# EAGLE schematic Avionics (EAGLE 9.5.1)
DESIGNER: Gabe Adamson; PART_NUMBER: 68-0004; PROJECT: CougSat-1: Avionics; REV: 1.3.0

## Sheet 1 of 14
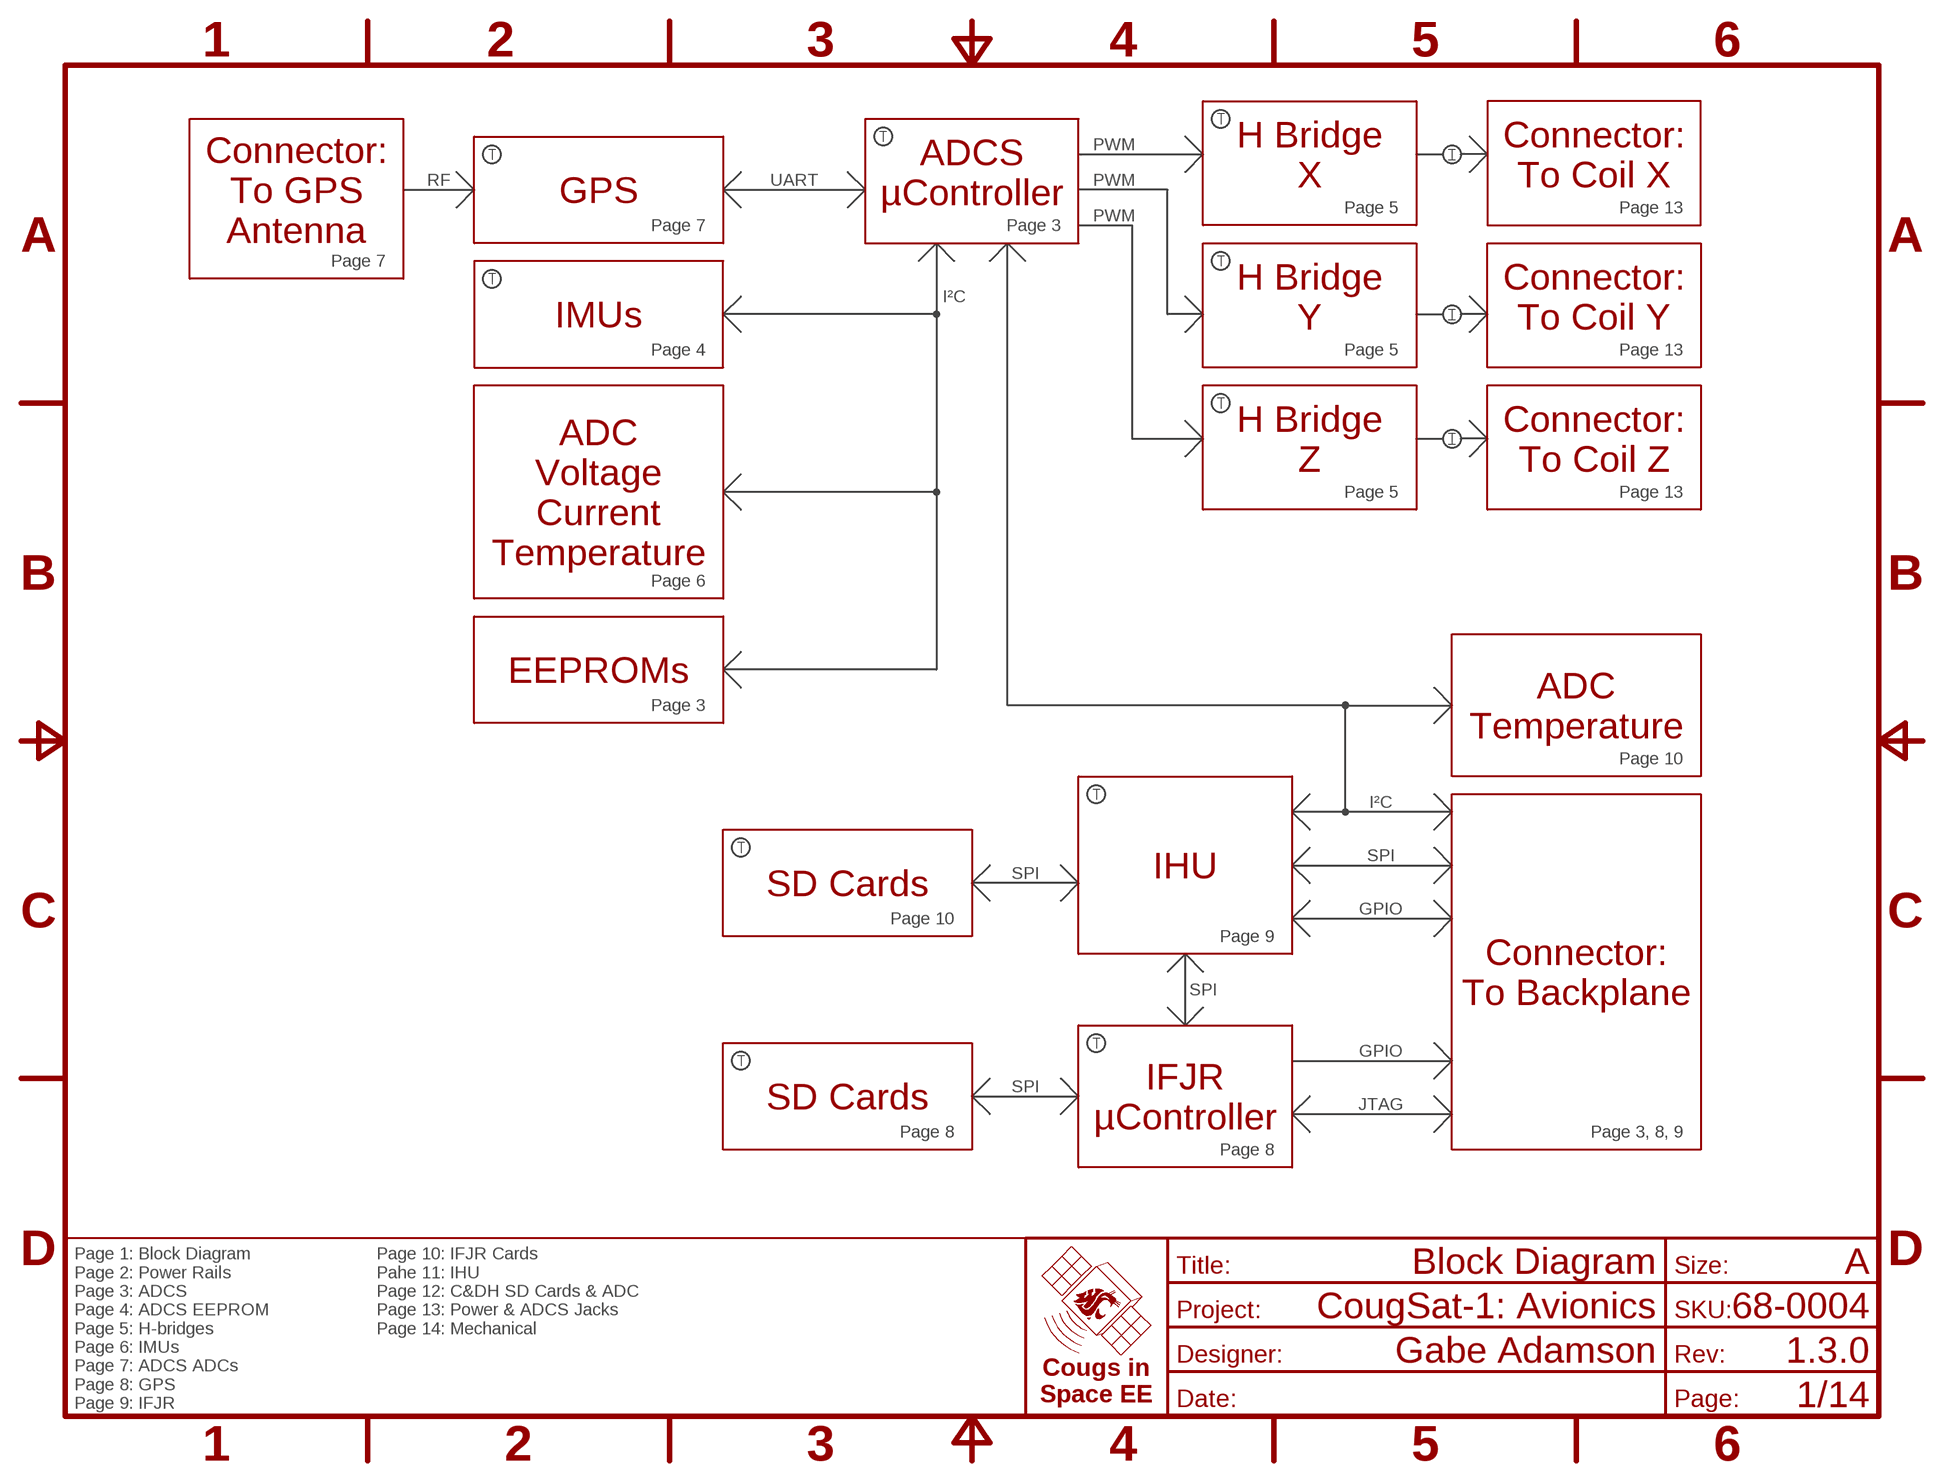
[diagram p0: schematic, sheet 1]
FRAME1 (FRAME-A): TITLE: Block Diagram

### Notes on the sheet
- PWM
- H Bridge
  X
- Connector:
  To Coil X
- ADCS
  µController
- RF | UART | PWM
- Connector:
  To GPS
  Antenna
- GPS
- Page 5 | Page 13
- Page 7 | Page 3 | PWM
- Page 7
- I²C
- H Bridge
  Y
- Connector:
  To Coil Y
- IMUs
- Page 4 | Page 5 | Page 13
- H Bridge
  Z
- Connector:
  To Coil Z
- ADC
  Voltage
  Current
  Temperature
- Page 5 | Page 13
- Page 6
- EEPROMs
- Page 3
- ADC
  Temperature
- Page 10
- I²C
- IHU | SPI
- SD Cards | SPI
- Page 10 | GPIO
- Page 9
- Connector:
  To Backplane
- SPI
- GPIO
- SD Cards | SPI
- IFJR
  µController
- JTAG
- Page 8 | Page 3, 8, 9
- Page 8
- Page 1: Block Diagram
  Page 2: Power Rails
  Page 3: ADCS
  Page 4: ADCS EEPROM
  Page 5: H-bridges
  Page 6: IMUs
  Page 7: ADCS ADCs
  Page 8: GPS
  Page 9: IFJR
- Page 10: IFJR Cards
  Pahe 11: IHU
  Page 12: C&DH SD Cards & ADC
  Page 13: Power & ADCS Jacks
  Page 14: Mechanical

## Sheet 2 of 14
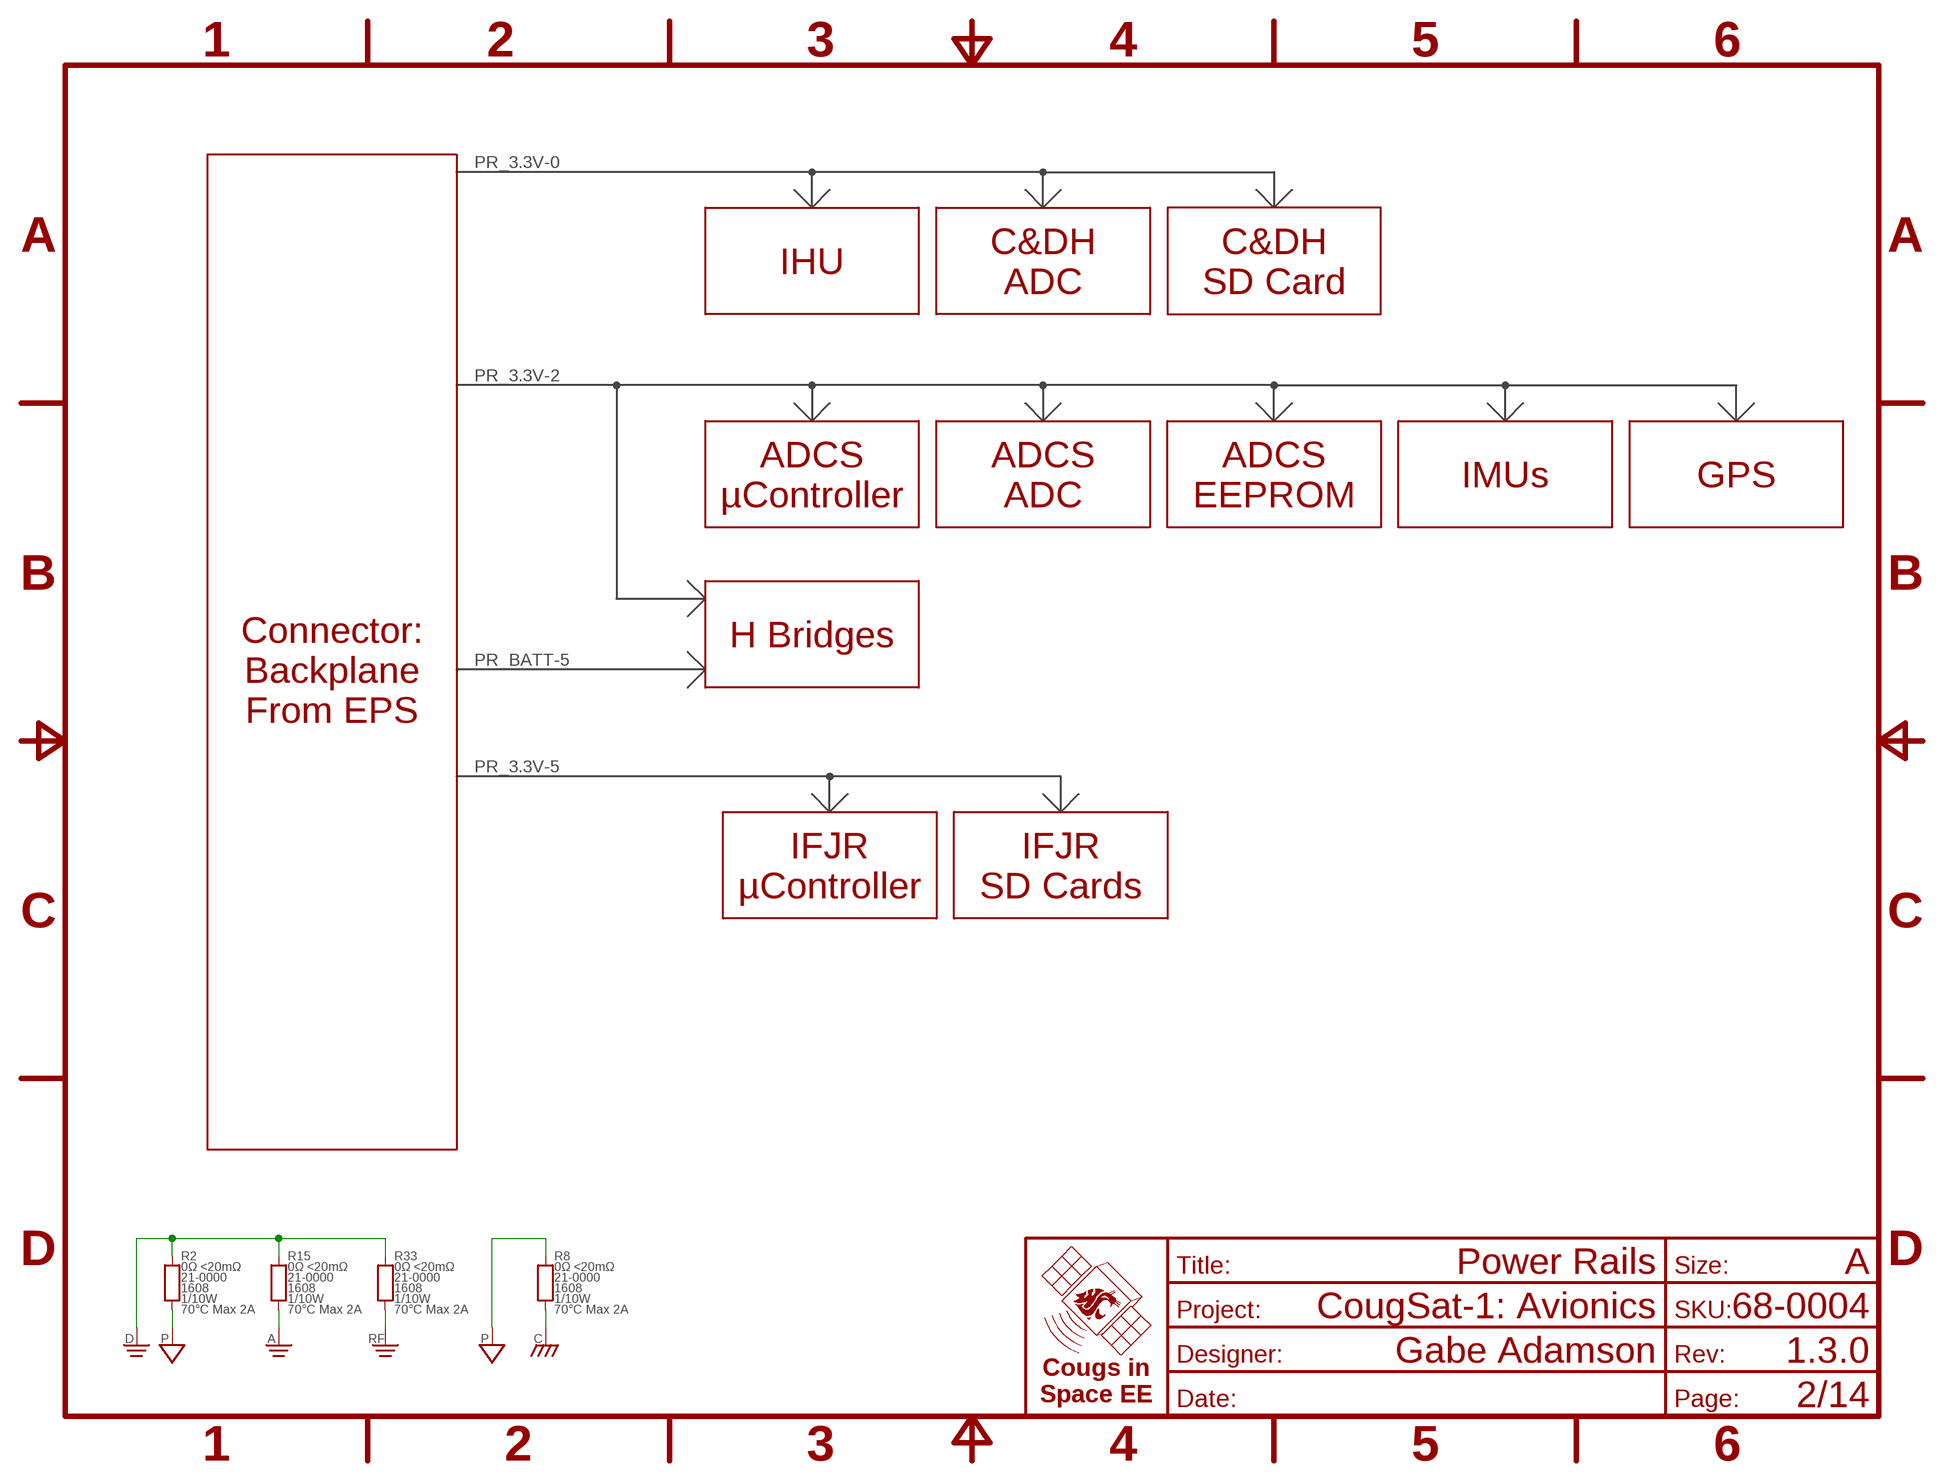
[diagram p1: schematic, sheet 2]
FRAME2 (FRAME-A): TITLE: Power Rails

### Parts
R2  0Ω <20mΩ  RES-V-0-1608  [1608]
R8  0Ω <20mΩ  RES-V-0-1608  [1608]
R15  0Ω <20mΩ  RES-V-0-1608  [1608]
R33  0Ω <20mΩ  RES-V-0-1608  [1608]

### Nets
AGND [Power]: R15.1 ; also sheet 3,5,6,7,8,9,10,11,12
CHASSIS [Power]: R8.1 ; also sheet 13
DGND [Power]: R2.2 R15.2 R33.2 ; also sheet 3,4,6,7,8,9,10,11,12,13
PGND [Power]: R2.1 R8.2 ; also sheet 5,13
RFGND [Power]: R33.1 ; also sheet 8

### Notes on the sheet
- PR_3.3V-0
- IHU
- C&DH
  ADC
- C&DH
  SD Card
- PR_3.3V-2
- ADCS
  µController
- ADCS
  ADC
- ADCS
  EEPROM
- IMUs | GPS
- H Bridges
- PR_BATT-5
- Connector:
  Backplane
  From EPS
- PR_3.3V-5
- IFJR
  µController
- IFJR
  SD Cards

## Sheet 3 of 14
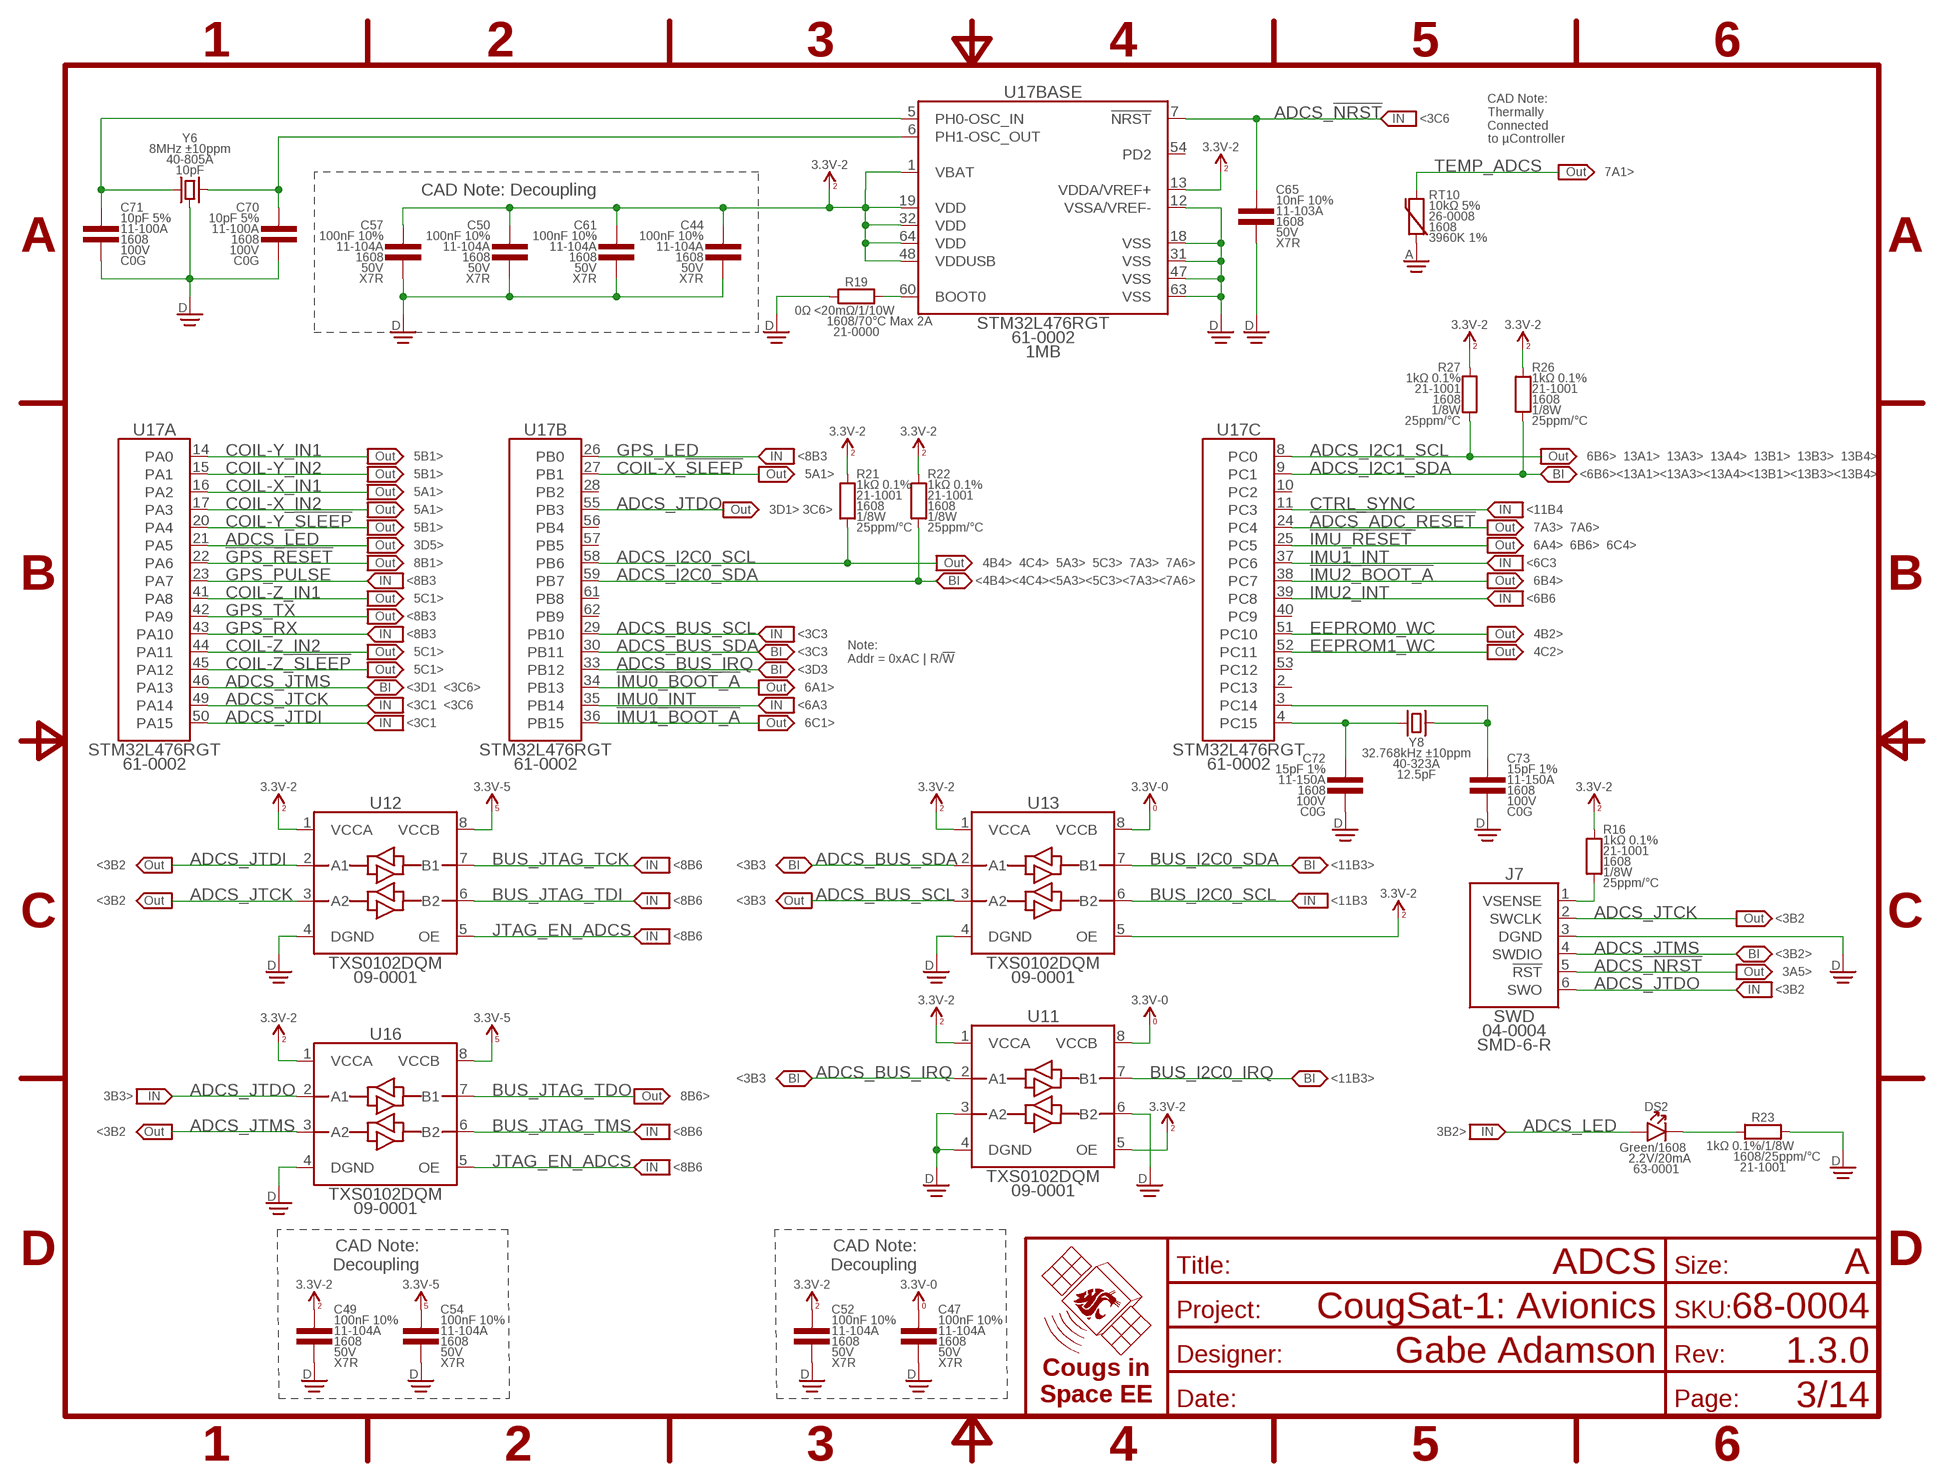
[diagram p2: schematic, sheet 3]
FRAME4 (FRAME-A): TITLE: ADCS

### Parts
C44  100nF 10%  CAP-V-100NF-1608  [1608]
C47  100nF 10%  CAP-V-100NF-1608  [1608]
C49  100nF 10%  CAP-V-100NF-1608  [1608]
C50  100nF 10%  CAP-V-100NF-1608  [1608]
C52  100nF 10%  CAP-V-100NF-1608  [1608]
C54  100nF 10%  CAP-V-100NF-1608  [1608]
C57  100nF 10%  CAP-V-100NF-1608  [1608]
C61  100nF 10%  CAP-V-100NF-1608  [1608]
C65  10nF 10%  CAP-V-10NF-1608  [1608]
C70  10pF 5%  CAP-V-10PF-1608  [1608]
C71  10pF 5%  CAP-V-10PF-1608  [1608]
C72  15pF 1%  CAP-V-15PF-1608  [1608]
C73  15pF 1%  CAP-V-15PF-1608  [1608]
DS2  Green  LED-H-GRN-1608  [1608-POL]
J7  SWD  SWDSMD-6-R  [SMD2.54-1X06-R]
R16  1kΩ 0.1%  RES-V-1K-1608  [1608]
R19  0Ω <20mΩ  RES-H-0-1608  [1608]
R21  1kΩ 0.1%  RES-V-1K-1608  [1608]
R22  1kΩ 0.1%  RES-V-1K-1608  [1608]
R23  1kΩ 0.1%  RES-H-1K-1608  [1608]
R26  1kΩ 0.1%  RES-V-1K-1608  [1608]
R27  1kΩ 0.1%  RES-V-1K-1608  [1608]
RT10  10kΩ 5%  THERMISTOR-V-10K-1608  [1608]
U11  TXS0102DQM  LEVEL_SHIFTER-2BIT-XSON-8  [X2SON-8]
U12  TXS0102DQM  LEVEL_SHIFTER-2BIT-XSON-8  [X2SON-8]
U13  TXS0102DQM  LEVEL_SHIFTER-2BIT-XSON-8  [X2SON-8]
U16  TXS0102DQM  LEVEL_SHIFTER-2BIT-XSON-8  [X2SON-8]
U17  STM32L476RGT  STM32-64P-L476RGT  [QFP-64-1010]
Y6  8MHz ±10ppm  CRYSTAL-GROUNDED-8M-SMD-5032  [SMD-5032]
Y8  32.768kHz ±10ppm  CRYSTAL-32.768K-SMD-3215  [SMD-3215]

### Nets
3.3V_0 [Power]: C47.1 U11.8(VCCB) U13.8(VCCB) ; supply symbol labelled 3.3V-0 ; also sheet 9,11,12,13
3.3V_2 [Power]: C44.1 C49.1 C50.1 C52.1 C57.1 C61.1 R16.2 R21.2 R22.2 R26.2 R27.2 U11.1(VCCA) U11.5(OE) U12.1(VCCA) U13.1(VCCA) U13.5(OE) U16.1(VCCA) U17.1(BASE:VBAT) U17.13(BASE:VDDA/VREF+) U17.19(BASE:VDD) U17.32(BASE:VDD) U17.48(BASE:VDDUSB) U17.64(BASE:VDD) ; supply symbol labelled 3.3V-2 ; also sheet 4,5,6,7,8,13
3.3V_5 [Power]: C54.1 U12.8(VCCB) U16.8(VCCB) ; supply symbol labelled 3.3V-5 ; also sheet 9,10,11,13
!ADCS_ADC_RESET!: U17.24(C:PC4) ; also sheet 7
!GPS_RESET: U17.22(A:PA6) ; also sheet 8
!IMU0_BOOT_A: U17.34(B:PB13) ; also sheet 6
!IMU1_BOOT_A: U17.36(B:PB15) ; also sheet 6
!IMU2_BOOT_A: U17.38(C:PC7) ; also sheet 6
!IMU_RESET: U17.25(C:PC5) ; also sheet 6
ADCS_!NRST: C65.1 J7.5(!RST) U17.7(BASE:!NRST)
ADCS_BOOT0: R19.2 U17.60(BASE:BOOT0)
ADCS_BUS_IRQ: U11.2(A1) U17.33(B:PB12)
ADCS_BUS_SCL: U13.3(A2) U17.29(B:PB10)
ADCS_BUS_SDA: U13.2(A1) U17.30(B:PB11)
ADCS_I2C0_SCL: R21.1 U17.58(B:PB6) ; also sheet 4,6,7
ADCS_I2C0_SDA: R22.1 U17.59(B:PB7) ; also sheet 4,6,7
ADCS_I2C1_SCL: R27.1 U17.8(C:PC0) ; also sheet 6,13
ADCS_I2C1_SDA: R26.1 U17.9(C:PC1) ; also sheet 6,13
ADCS_JTCK: J7.2(SWCLK) U12.3(A2) U17.49(A:PA14)
ADCS_JTDI: U12.2(A1) U17.50(A:PA15)
ADCS_JTDO: J7.6(SWO) U16.2(A1) U17.55(B:PB3)
ADCS_JTMS: J7.4(SWDIO) U16.3(A2) U17.46(A:PA13)
ADCS_LED: DS2.A U17.21(A:PA5)
ADCS_LED_GND: DS2.C R23.1
ADCS_OSC_32_IN: C72.1 U17.4(C:PC15) Y8.1
ADCS_OSC_32_OUT: C73.1 U17.3(C:PC14) Y8.2
ADCS_OSC_IN [Power]: C71.1 U17.5(BASE:PH0-OSC_IN) Y6.1
ADCS_OSC_OUT: C70.1 U17.6(BASE:PH1-OSC_OUT) Y6.3
ADCS_SWD_VSENCE: J7.1(VSENSE) R16.1
AGND [Power]: RT10.1 ; also sheet 2,5,6,7,8,9,10,11,12
BUS_I2C0_IRQ: U11.7(B1) ; also sheet 11
BUS_I2C0_SCL: U13.6(B2) ; also sheet 11
BUS_I2C0_SDA: U13.7(B1) ; also sheet 11
BUS_JTAG_TCK: U12.7(B1) ; also sheet 9,11
BUS_JTAG_TDI: U12.6(B2) ; also sheet 9,11
BUS_JTAG_TDO: U16.7(B1) ; also sheet 9,11
BUS_JTAG_TMS: U16.6(B2) ; also sheet 9,11
COIL-X_!SLEEP: U17.27(B:PB1) ; also sheet 5
COIL-X_IN1: U17.16(A:PA2) ; also sheet 5
COIL-X_IN2: U17.17(A:PA3) ; also sheet 5
COIL-Y_!SLEEP: U17.20(A:PA4) ; also sheet 5
COIL-Y_IN1: U17.14(A:PA0) ; also sheet 5
COIL-Y_IN2: U17.15(A:PA1) ; also sheet 5
COIL-Z_!SLEEP: U17.45(A:PA12) ; also sheet 5
COIL-Z_IN1: U17.41(A:PA8) ; also sheet 5
COIL-Z_IN2: U17.44(A:PA11) ; also sheet 5
CTRL_SYNC: U17.11(C:PC3) ; also sheet 9,11
DGND [Power]: C44.2 C47.2 C49.2 C50.2 C52.2 C54.2 C57.2 C61.2 C65.2 C70.2 C71.2 C72.2 C73.2 J7.3(DGND) R19.1 R23.2 U11.3(A2) U11.4(DGND) U11.6(B2) U12.4(DGND) U13.4(DGND) U16.4(DGND) U17.12(BASE:VSSA/VREF-) U17.18(BASE:VSS) U17.31(BASE:VSS) U17.47(BASE:VSS) U17.63(BASE:VSS) Y6.2(GND) Y6.4(GND) ; also sheet 2,4,6,7,8,9,10,11,12,13
EEPROM0_WC: U17.51(C:PC10) ; also sheet 4
EEPROM1_WC: U17.52(C:PC11) ; also sheet 4
GPS_LED: U17.26(B:PB0) ; also sheet 8
GPS_PULSE: U17.23(A:PA7) ; also sheet 8
GPS_RX: U17.43(A:PA10) ; also sheet 8
GPS_TX: U17.42(A:PA9) ; also sheet 8
IMU0_INT: U17.35(B:PB14) ; also sheet 6
IMU1_INT: U17.37(C:PC6) ; also sheet 6
IMU2_INT: U17.39(C:PC8) ; also sheet 6
JTAG_EN_ADCS: U12.5(OE) U16.5(OE) ; also sheet 9
TEMP_ADCS: RT10.2 ; also sheet 7
Unconnected: U17.2(C:PC13) U17.10(C:PC2) U17.28(B:PB2) U17.40(C:PC9) U17.53(C:PC12) U17.54(BASE:EXTRA_PIN) U17.56(B:PB4) U17.57(B:PB5) U17.61(B:PB8) U17.62(B:PB9)

### Notes on the sheet
- <3C6
- CAD Note:
  Thermally
  Connected
  to µController
- 7A1>
- CAD Note: Decoupling
- 5B1> | <8B3 | 6B6>  13A1>  13A3>  13A4>  13B1>  13B3>  13B4>
- 5B1> | 5A1> | <6B6><13A1><13A3><13A4><13B1><13B3><13B4>
- 5A1>
- 5A1> | 3D1> 3C6> | <11B4
- 5B1> | 7A3>  7A6>
- 3D5> | 6A4>  6B6>  6C4>
- 8B1> | 4B4>  4C4>  5A3>  5C3>  7A3>  7A6> | <6C3
- <8B3 | <4B4><4C4><5A3><5C3><7A3><7A6> | 6B4>
- 5C1> | <6B6
- <8B3
- <8B3 | <3C3 | 4B2>
- 5C1> | <3C3
- Note:
  Addr = 0xAC | R/!W!
- 4C2>
- 5C1> | <3D3
- <3D1  <3C6> | 6A1>
- <3C1  <3C6 | <6A3
- <3C1 | 6C1>
- <3B2 | <8B6 | <3B3 | <11B3>
- <3B2 | <8B6 | <3B3 | <11B3
- <3B2
- <8B6
- <3B2>
- 3A5>
- <3B2
- <3B3 | <11B3>
- 3B3> | 8B6>
- <3B2 | <8B6 | 3B2>
- <8B6
- CAD Note:
  Decoupling
- CAD Note:
  Decoupling

## Sheet 4 of 14
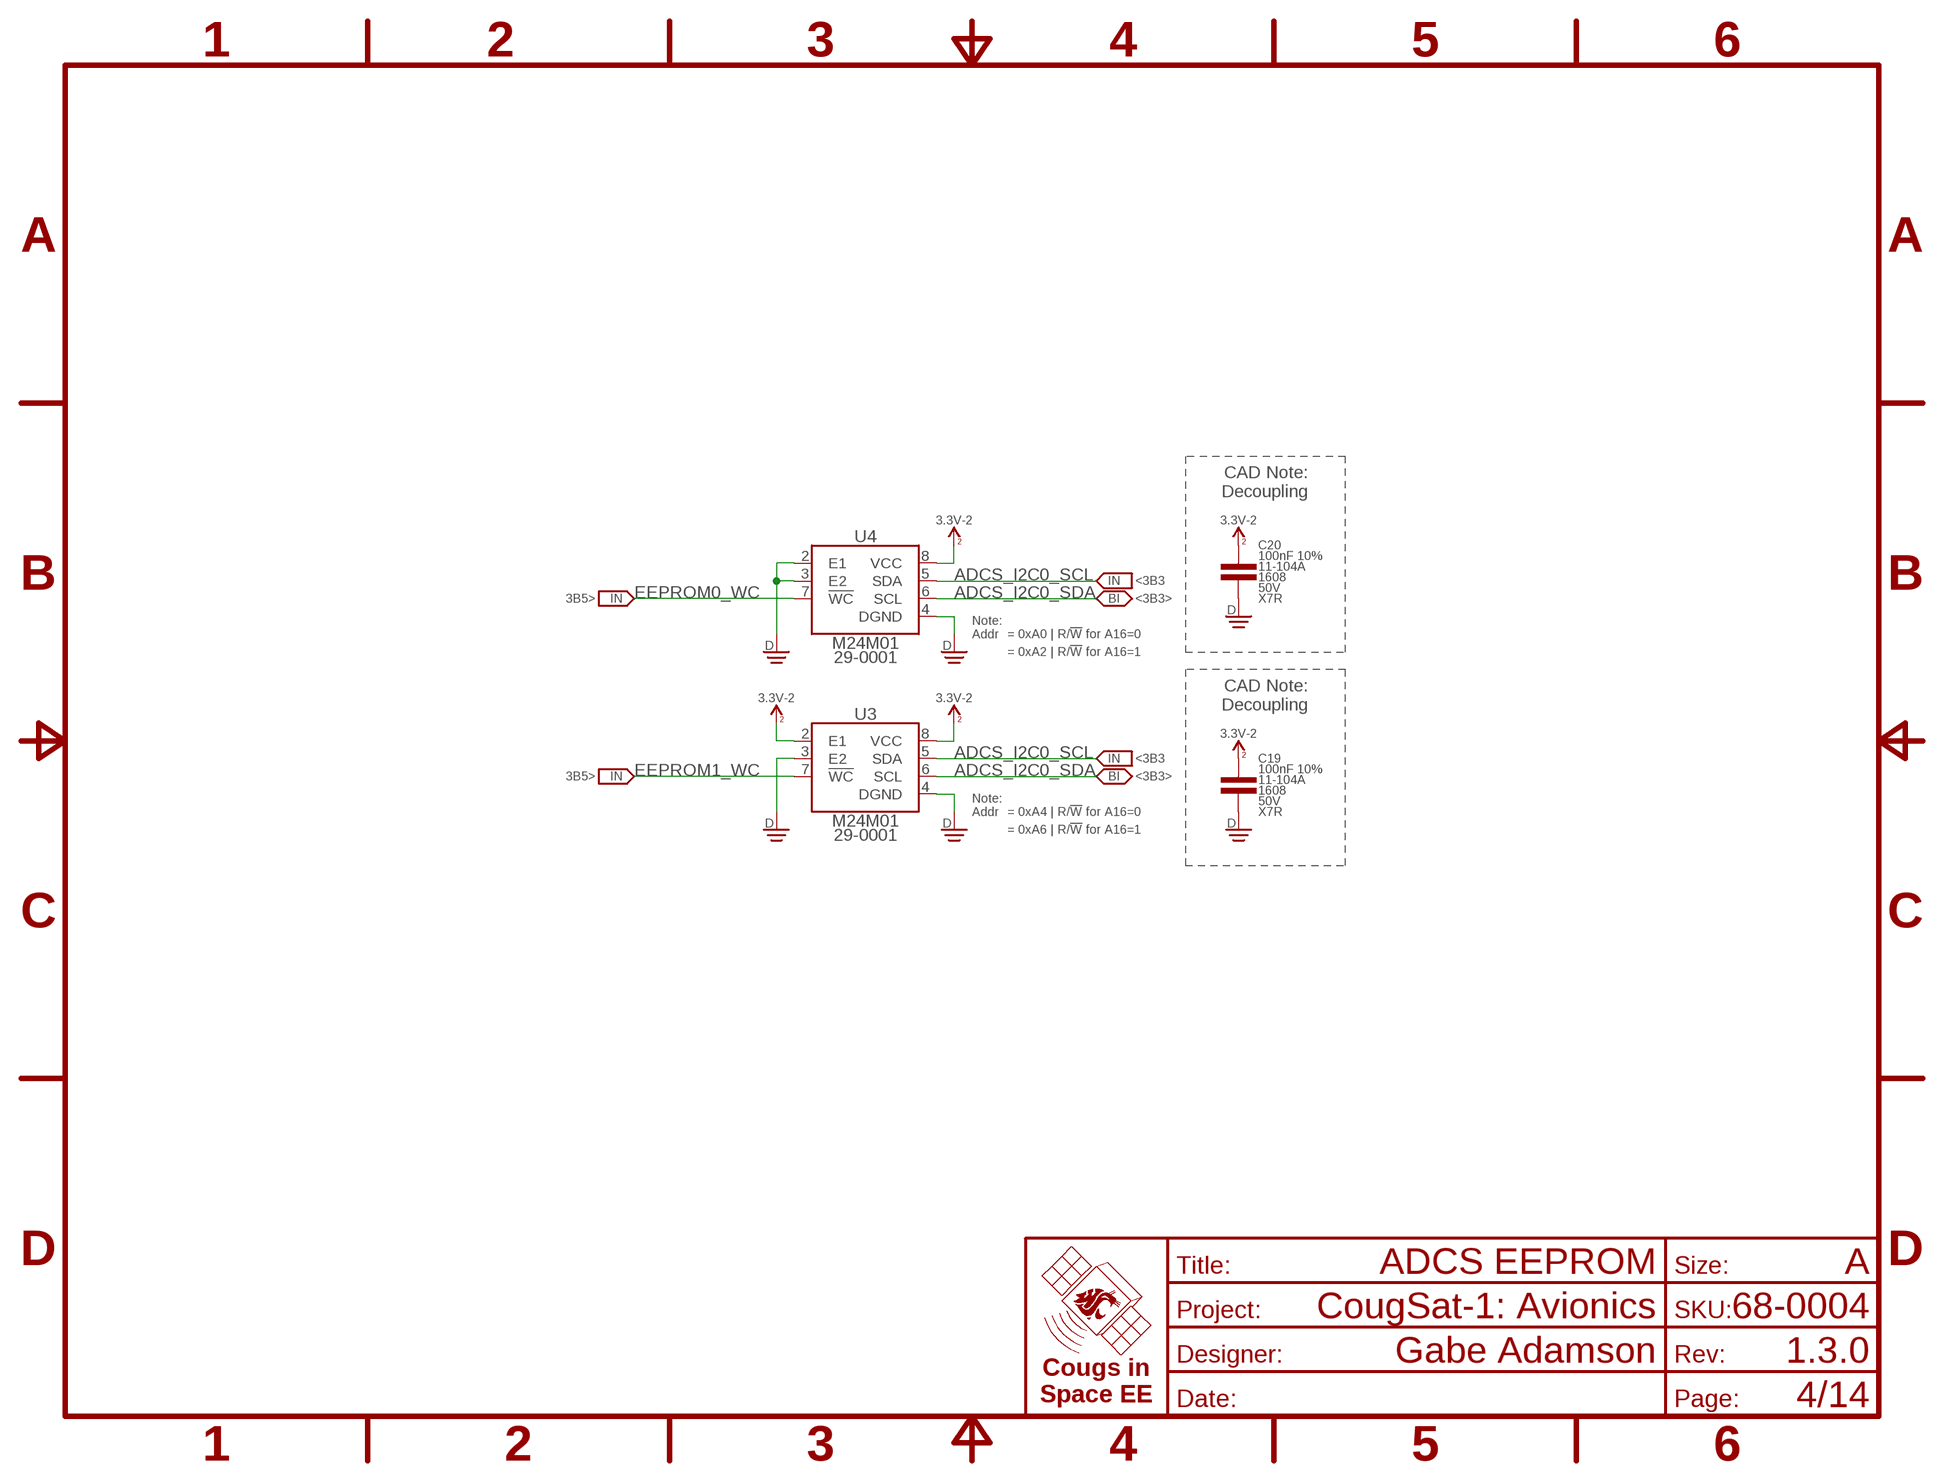
[diagram p3: schematic, sheet 4]
FRAME13 (FRAME-A): TITLE: ADCS EEPROM

### Parts
C19  100nF 10%  CAP-V-100NF-1608  [1608]
C20  100nF 10%  CAP-V-100NF-1608  [1608]
U3  M24M01  EEPROM-I2C-4-128KB-SO8  [SO8]
U4  M24M01  EEPROM-I2C-4-128KB-SO8  [SO8]

### Nets
3.3V_2 [Power]: C19.1 C20.1 U3.2(E1) U3.8(VCC) U4.8(VCC) ; supply symbol labelled 3.3V-2 ; also sheet 3,5,6,7,8,13
ADCS_I2C0_SCL: U3.5(SDA) U4.5(SDA) ; also sheet 3,6,7
ADCS_I2C0_SDA: U3.6(SCL) U4.6(SCL) ; also sheet 3,6,7
DGND [Power]: C19.2 C20.2 U3.3(E2) U3.4(DGND) U4.2(E1) U4.3(E2) U4.4(DGND) ; also sheet 2,3,6,7,8,9,10,11,12,13
EEPROM0_WC: U4.7(!WC) ; also sheet 3
EEPROM1_WC: U3.7(!WC) ; also sheet 3

### Notes on the sheet
- CAD Note:
  Decoupling
- <3B3
- 3B5> | <3B3>
- Note:
  Addr
- = 0xA0 | R/!W! for A16=0
- = 0xA2 | R/!W! for A16=1
- CAD Note:
  Decoupling
- <3B3
- 3B5> | <3B3>
- Note:
  Addr
- = 0xA4 | R/!W! for A16=0
- = 0xA6 | R/!W! for A16=1

## Sheet 5 of 14
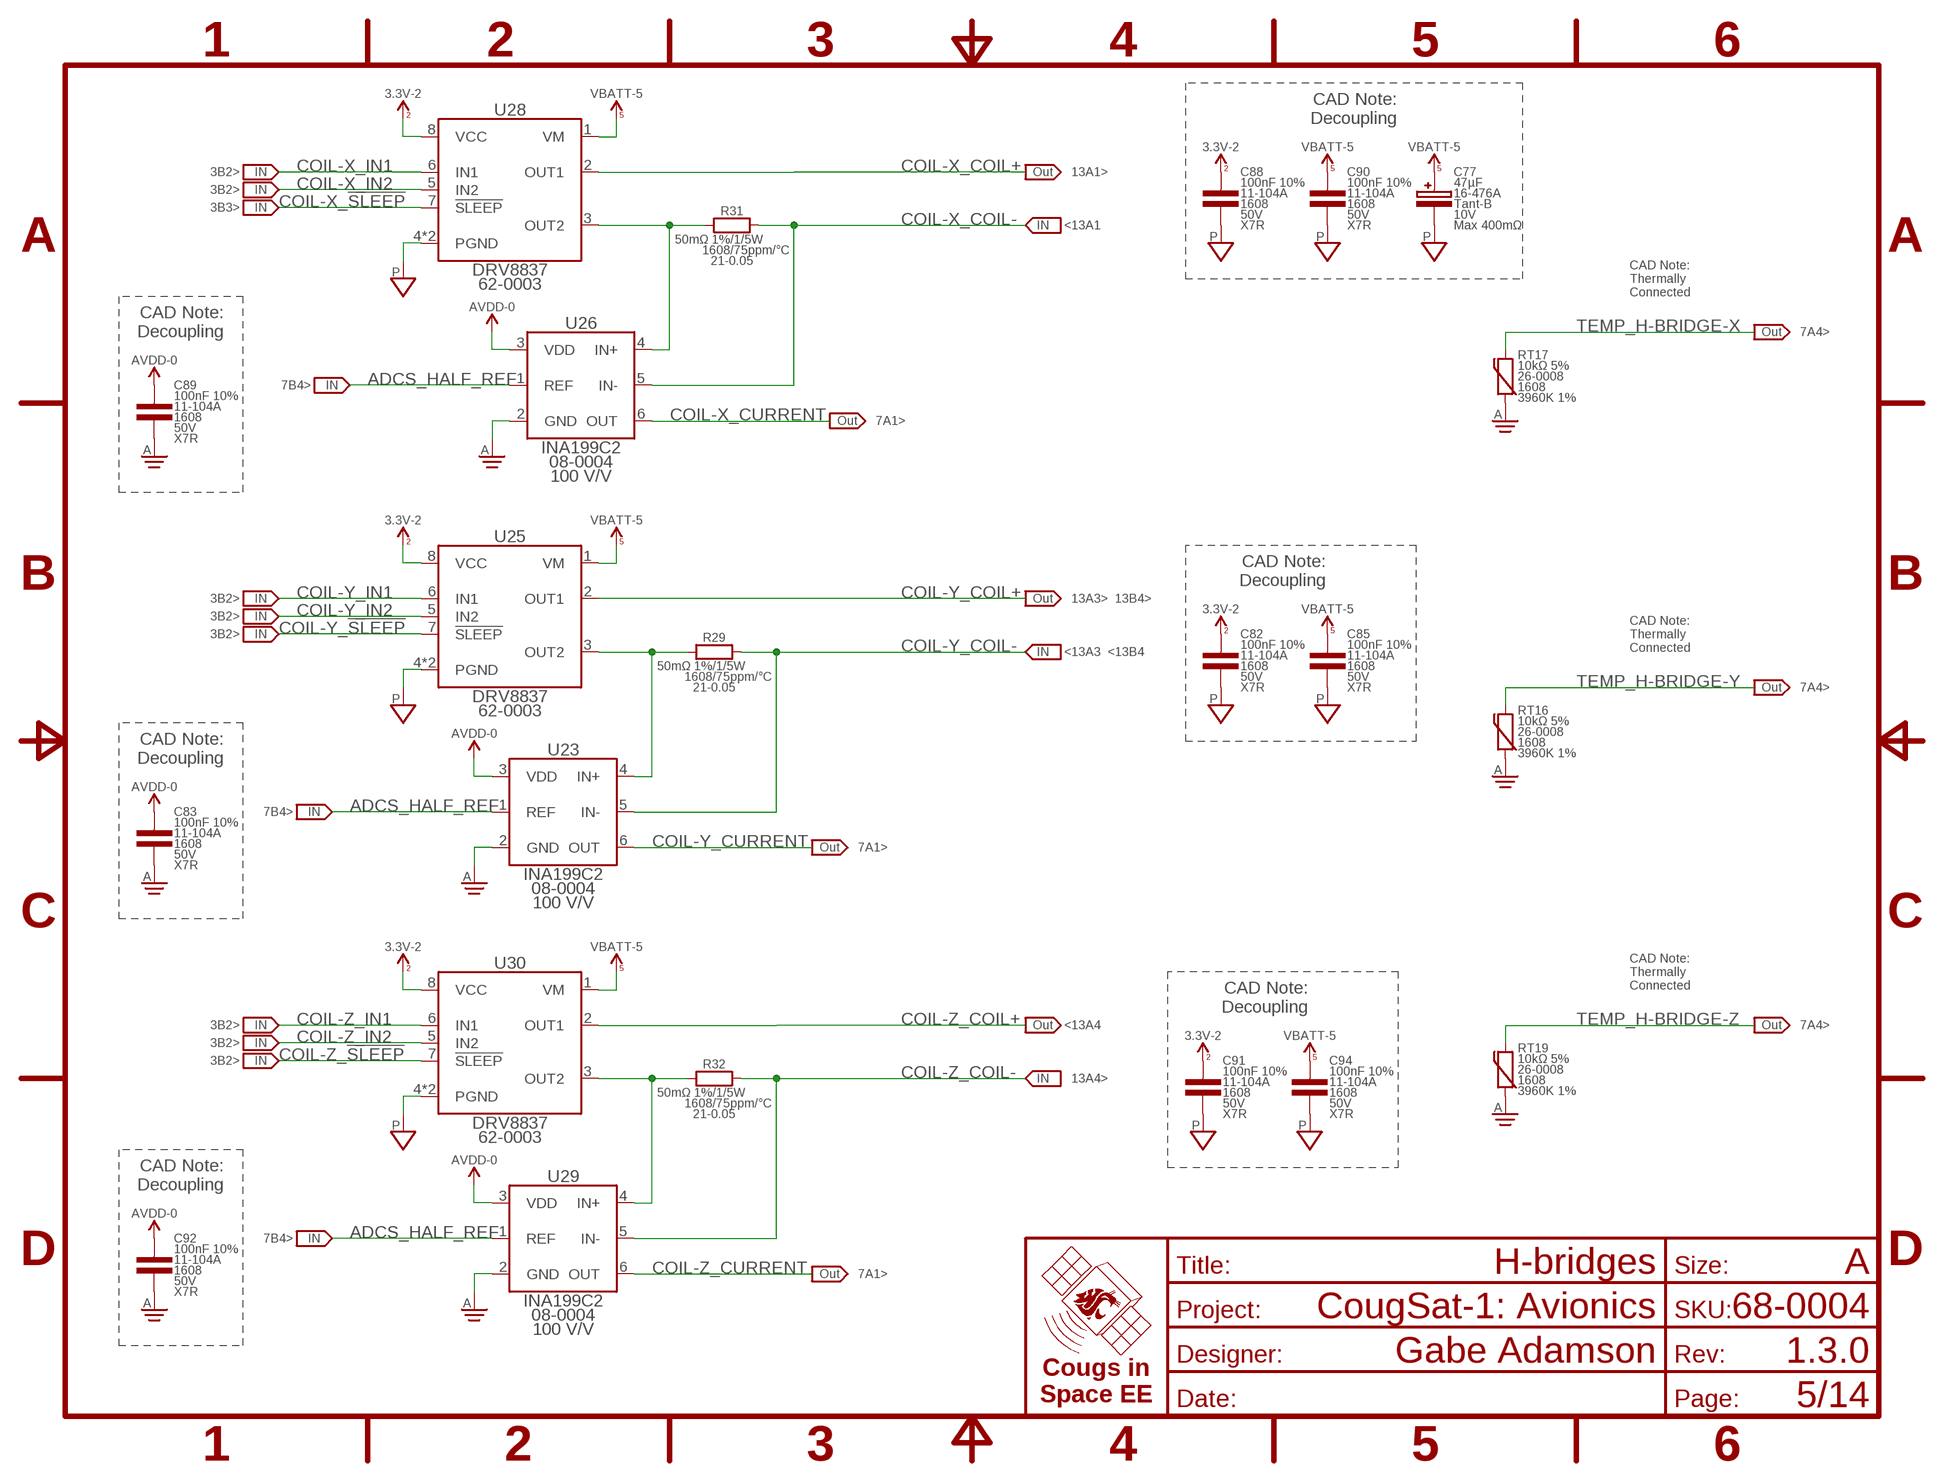
[diagram p4: schematic, sheet 5]
FRAME5 (FRAME-A): TITLE: H-bridges

### Parts
C77  47µF  CAP-POL-V-47UF-4028  [4028-POL]
C82  100nF 10%  CAP-V-100NF-1608  [1608]
C83  100nF 10%  CAP-V-100NF-1608  [1608]
C85  100nF 10%  CAP-V-100NF-1608  [1608]
C88  100nF 10%  CAP-V-100NF-1608  [1608]
C89  100nF 10%  CAP-V-100NF-1608  [1608]
C90  100nF 10%  CAP-V-100NF-1608  [1608]
C91  100nF 10%  CAP-V-100NF-1608  [1608]
C92  100nF 10%  CAP-V-100NF-1608  [1608]
C94  100nF 10%  CAP-V-100NF-1608  [1608]
R29  50mΩ 1%  RES-H-0.05R-1608  [1608]
R31  50mΩ 1%  RES-H-0.05R-1608  [1608]
R32  50mΩ 1%  RES-H-0.05R-1608  [1608]
RT16  10kΩ 5%  THERMISTOR-V-10K-1608  [1608]
RT17  10kΩ 5%  THERMISTOR-V-10K-1608  [1608]
RT19  10kΩ 5%  THERMISTOR-V-10K-1608  [1608]
U23  INA199C2  [SOT363]
U25  DRV8837  [WSON-8]
U26  INA199C2  [SOT363]
U28  DRV8837  [WSON-8]
U29  INA199C2  [SOT363]
U30  DRV8837  [WSON-8]

### Nets
3.3V_2 [Power]: C82.1 C88.1 C91.1 U25.8(VCC) U28.8(VCC) U30.8(VCC) ; supply symbol labelled 3.3V-2 ; also sheet 3,4,6,7,8,13
ADCS_HALF_REF: U23.1(REF) U26.1(REF) U29.1(REF) ; also sheet 7
AGND [Power]: C83.2 C89.2 C92.2 RT16.1 RT17.1 RT19.1 U23.2(GND) U26.2(GND) U29.2(GND) ; also sheet 2,3,6,7,8,9,10,11,12
AVDD-0 [Power]: C83.1 C89.1 C92.1 U23.3(VDD) U26.3(VDD) U29.3(VDD) ; also sheet 7
COIL-X_!SLEEP: U28.7(!SLEEP) ; also sheet 3
COIL-X_COIL+: U28.2(OUT1) ; also sheet 13
COIL-X_COIL-: R31.2 U26.5(IN-) ; also sheet 13
COIL-X_CURRENT: U26.6(OUT) ; also sheet 7
COIL-X_IN1: U28.6(IN1) ; also sheet 3
COIL-X_IN2: U28.5(IN2) ; also sheet 3
COIL-X_OUT2: R31.1 U26.4(IN+) U28.3(OUT2)
COIL-Y_!SLEEP: U25.7(!SLEEP) ; also sheet 3
COIL-Y_COIL+: U25.2(OUT1) ; also sheet 13
COIL-Y_COIL-: R29.2 U23.5(IN-) ; also sheet 13
COIL-Y_CURRENT: U23.6(OUT) ; also sheet 7
COIL-Y_IN1: U25.6(IN1) ; also sheet 3
COIL-Y_IN2: U25.5(IN2) ; also sheet 3
COIL-Y_OUT2: R29.1 U23.4(IN+) U25.3(OUT2)
COIL-Z_!SLEEP: U30.7(!SLEEP) ; also sheet 3
COIL-Z_COIL+: U30.2(OUT1) ; also sheet 13
COIL-Z_COIL-: R32.2 U29.5(IN-) ; also sheet 13
COIL-Z_CURRENT: U29.6(OUT) ; also sheet 7
COIL-Z_IN1: U30.6(IN1) ; also sheet 3
COIL-Z_IN2: U30.5(IN2) ; also sheet 3
COIL-Z_OUT2: R32.1 U29.4(IN+) U30.3(OUT2)
PGND [Power]: C77.C C82.2 C85.2 C88.2 C90.2 C91.2 C94.2 U25.4(PGND) U25.PAD(PGND) U28.4(PGND) U28.PAD(PGND) U30.4(PGND) U30.PAD(PGND) ; also sheet 2,13
TEMP_H-BRIDGE-X: RT17.2 ; also sheet 7
TEMP_H-BRIDGE-Y: RT16.2 ; also sheet 7
TEMP_H-BRIDGE-Z: RT19.2 ; also sheet 7
VBATT_5 [Power]: C77.A C85.1 C90.1 C94.1 U25.1(VM) U28.1(VM) U30.1(VM) ; supply symbol labelled VBATT-5 ; also sheet 13

### Notes on the sheet
- CAD Note:
  Decoupling
- 3B2> | 13A1>
- 3B2>
- 3B3>
- <13A1
- CAD Note:
  Thermally
  Connected
- 7A4>
- CAD Note:
  Decoupling
- 7B4>
- 7A1>
- CAD Note:
  Decoupling
- 3B2> | 13A3>  13B4>
- 3B2>
- 3B2>
- CAD Note:
  Thermally
  Connected
- <13A3  <13B4
- 7A4>
- CAD Note:
  Decoupling
- 7B4>
- 7A1>
- CAD Note:
  Thermally
  Connected
- CAD Note:
  Decoupling
- 3B2> | <13A4 | 7A4>
- 3B2>
- 3B2>
- 13A4>
- CAD Note:
  Decoupling
- 7B4>
- 7A1>

## Sheet 6 of 14
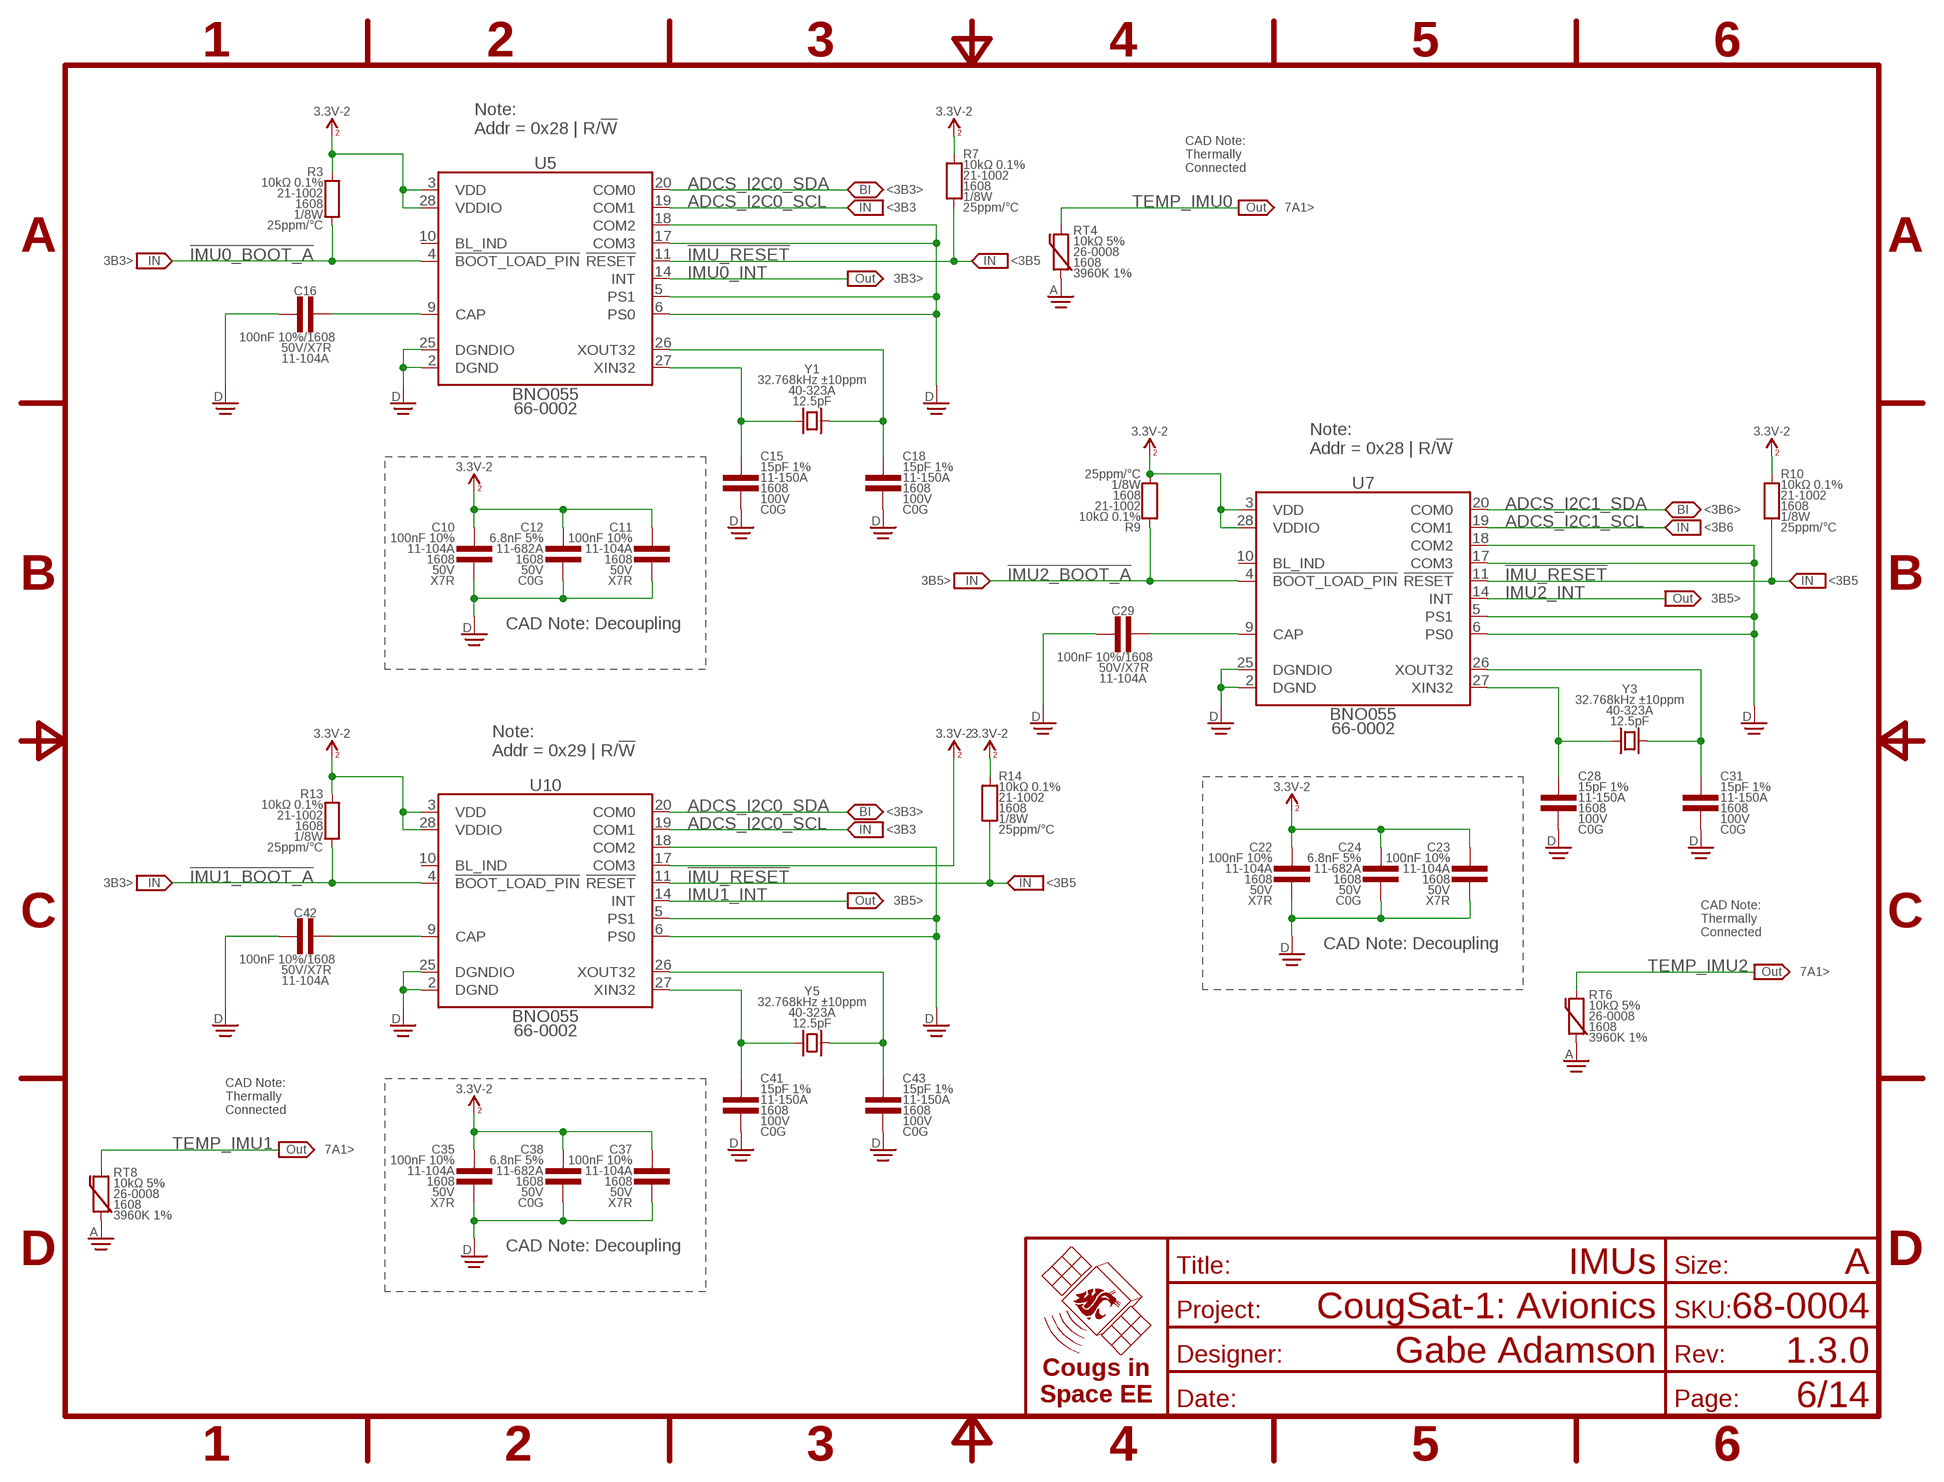
[diagram p5: schematic, sheet 6]
FRAME3 (FRAME-A): TITLE: IMUs

### Parts
C10  100nF 10%  CAP-V-100NF-1608  [1608]
C11  100nF 10%  CAP-V-100NF-1608  [1608]
C12  6.8nF 5%  CAP-V-6.8NF-1608  [1608]
C15  15pF 1%  CAP-V-15PF-1608  [1608]
C16  100nF 10%  CAP-H-100NF-1608  [1608]
C18  15pF 1%  CAP-V-15PF-1608  [1608]
C22  100nF 10%  CAP-V-100NF-1608  [1608]
C23  100nF 10%  CAP-V-100NF-1608  [1608]
C24  6.8nF 5%  CAP-V-6.8NF-1608  [1608]
C28  15pF 1%  CAP-V-15PF-1608  [1608]
C29  100nF 10%  CAP-H-100NF-1608  [1608]
C31  15pF 1%  CAP-V-15PF-1608  [1608]
C35  100nF 10%  CAP-V-100NF-1608  [1608]
C37  100nF 10%  CAP-V-100NF-1608  [1608]
C38  6.8nF 5%  CAP-V-6.8NF-1608  [1608]
C41  15pF 1%  CAP-V-15PF-1608  [1608]
C42  100nF 10%  CAP-H-100NF-1608  [1608]
C43  15pF 1%  CAP-V-15PF-1608  [1608]
R3  10kΩ 0.1%  RES-V-10K-1608  [1608]
R7  10kΩ 0.1%  RES-V-10K-1608  [1608]
R9  10kΩ 0.1%  RES-V-10K-1608  [1608]
R10  10kΩ 0.1%  RES-V-10K-1608  [1608]
R13  10kΩ 0.1%  RES-V-10K-1608  [1608]
R14  10kΩ 0.1%  RES-V-10K-1608  [1608]
RT4  10kΩ 5%  THERMISTOR-V-10K-1608  [1608]
RT6  10kΩ 5%  THERMISTOR-V-10K-1608  [1608]
RT8  10kΩ 5%  THERMISTOR-V-10K-1608  [1608]
U5  BNO055  [LGA-28-4050]
U7  BNO055  [LGA-28-4050]
U10  BNO055  [LGA-28-4050]
Y1  32.768kHz ±10ppm  CRYSTAL-32.768K-SMD-3215  [SMD-3215]
Y3  32.768kHz ±10ppm  CRYSTAL-32.768K-SMD-3215  [SMD-3215]
Y5  32.768kHz ±10ppm  CRYSTAL-32.768K-SMD-3215  [SMD-3215]

### Nets
3.3V_2 [Power]: C10.1 C11.1 C12.1 C22.1 C23.1 C24.1 C35.1 C37.1 C38.1 R3.2 R7.2 R9.1 R10.2 R13.2 R14.2 U5.3(VDD) U5.28(VDDIO) U7.3(VDD) U7.28(VDDIO) U10.3(VDD) U10.17(COM3) U10.28(VDDIO) ; supply symbol labelled 3.3V-2 ; also sheet 3,4,5,7,8,13
!IMU0_BOOT_A: R3.1 U5.4(!BOOT_LOAD_PIN) ; also sheet 3
!IMU1_BOOT_A: R13.1 U10.4(!BOOT_LOAD_PIN) ; also sheet 3
!IMU2_BOOT_A: R9.2 U7.4(!BOOT_LOAD_PIN) ; also sheet 3
!IMU_RESET: R7.1 R10.1 R14.1 U5.11(!RESET) U7.11(!RESET) U10.11(!RESET) ; also sheet 3
ADCS_I2C0_SCL: U5.19(COM1) U10.19(COM1) ; also sheet 3,4,7
ADCS_I2C0_SDA: U5.20(COM0) U10.20(COM0) ; also sheet 3,4,7
ADCS_I2C1_SCL: U7.19(COM1) ; also sheet 3,13
ADCS_I2C1_SDA: U7.20(COM0) ; also sheet 3,13
ADCS_IMU1_OSC_32_IN: C41.1 U10.27(XIN32) Y5.2
ADCS_IMU1_OSC_32_IN1: C15.1 U5.27(XIN32) Y1.2
ADCS_IMU1_OSC_32_IN2: C28.1 U7.27(XIN32) Y3.2
ADCS_IMU1_OSC_32_OUT: C43.1 U10.26(XOUT32) Y5.1
ADCS_IMU1_OSC_32_OUT1: C18.1 U5.26(XOUT32) Y1.1
ADCS_IMU1_OSC_32_OUT2: C31.1 U7.26(XOUT32) Y3.1
AGND [Power]: RT4.1 RT6.1 RT8.1 ; also sheet 2,3,5,7,8,9,10,11,12
DGND [Power]: C10.2 C11.2 C12.2 C15.2 C16.1 C18.2 C22.2 C23.2 C24.2 C28.2 C29.1 C31.2 C35.2 C37.2 C38.2 C41.2 C42.1 C43.2 U5.2(DGND) U5.5(PS1) U5.6(PS0) U5.17(COM3) U5.18(COM2) U5.25(DGNDIO) U7.2(DGND) U7.5(PS1) U7.6(PS0) U7.17(COM3) U7.18(COM2) U7.25(DGNDIO) U10.2(DGND) U10.5(PS1) U10.6(PS0) U10.18(COM2) U10.25(DGNDIO) ; also sheet 2,3,4,7,8,9,10,11,12,13
IMU0_CAP: C16.2 U5.9(CAP)
IMU0_INT: U5.14(INT) ; also sheet 3
IMU1_CAP: C42.2 U10.9(CAP)
IMU1_INT: U10.14(INT) ; also sheet 3
IMU2_CAP: C29.2 U7.9(CAP)
IMU2_INT: U7.14(INT) ; also sheet 3
TEMP_IMU0: RT4.2 ; also sheet 7
TEMP_IMU1: RT8.2 ; also sheet 7
TEMP_IMU2: RT6.2 ; also sheet 7
Unconnected: U5.10(BL_IND) U7.10(BL_IND) U10.10(BL_IND)

### Notes on the sheet
- Note:
  Addr = 0x28 | R/!W
- CAD Note:
  Thermally
  Connected
- <3B3>
- <3B3 | 7A1>
- 3B3> | <3B5
- 3B3>
- Note:
  Addr = 0x28 | R/!W
- <3B6>
- <3B6
- 3B5> | <3B5
- 3B5>
- CAD Note: Decoupling
- Note:
  Addr = 0x29 | R/!W
- <3B3>
- <3B3
- 3B3> | <3B5
- 3B5>
- CAD Note:
  Thermally
  Connected
- CAD Note: Decoupling
- 7A1>
- CAD Note:
  Thermally
  Connected
- 7A1>
- CAD Note: Decoupling

## Sheet 7 of 14
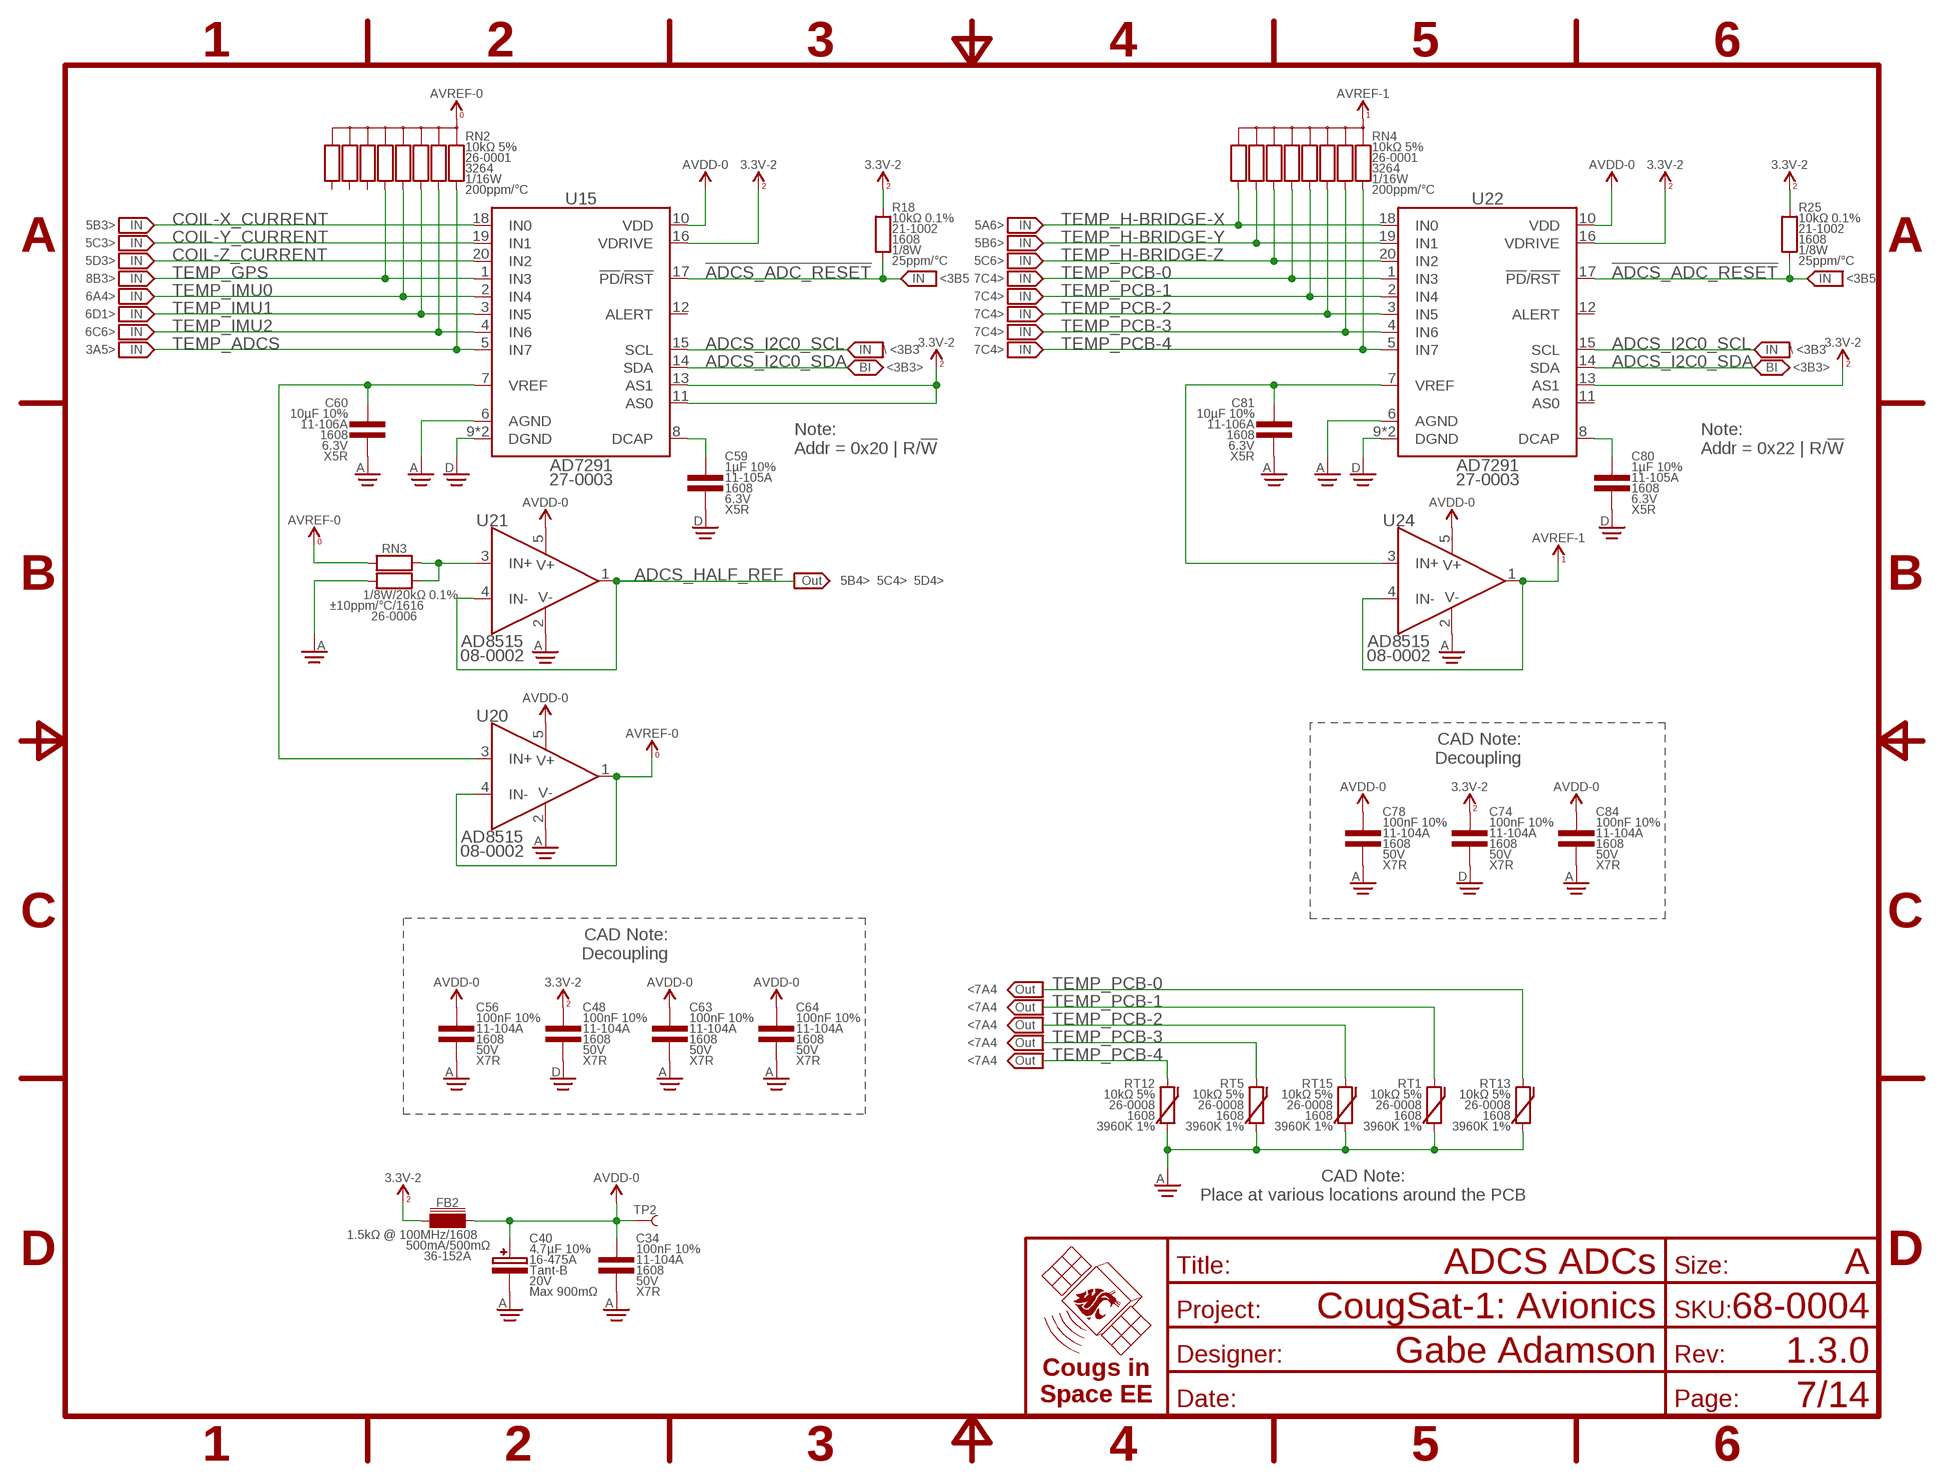
[diagram p6: schematic, sheet 7]
FRAME6 (FRAME-A): TITLE: ADCS ADCs

### Parts
C34  100nF 10%  CAP-V-100NF-1608  [1608]
C40  4.7µF 10%  CAP-POL-V-4.7UF-4028  [4028-POL]
C48  100nF 10%  CAP-V-100NF-1608  [1608]
C56  100nF 10%  CAP-V-100NF-1608  [1608]
C59  1µF 10%  CAP-V-1UF-1608  [1608]
C60  10µF 10%  CAP-V-10UF-1608  [1608]
C63  100nF 10%  CAP-V-100NF-1608  [1608]
C64  100nF 10%  CAP-V-100NF-1608  [1608]
C74  100nF 10%  CAP-V-100NF-1608  [1608]
C78  100nF 10%  CAP-V-100NF-1608  [1608]
C80  1µF 10%  CAP-V-1UF-1608  [1608]
C81  10µF 10%  CAP-V-10UF-1608  [1608]
C84  100nF 10%  CAP-V-100NF-1608  [1608]
FB2  1.5kΩ @ 100MHz  CHOKE-H-1.5K-1608  [1608]
R18  10kΩ 0.1%  RES-V-10K-1608  [1608]
R25  10kΩ 0.1%  RES-V-10K-1608  [1608]
RN2  10kΩ 5%  RES_BUS-10-10K-3264  [3264]
RN3  20kΩ 0.1%  RES-H-PAIRED-20K-1616  [1616]
RN4  10kΩ 5%  RES_BUS-10-10K-3264  [3264]
RT1  10kΩ 5%  THERMISTOR-V-10K-1608  [1608]
RT5  10kΩ 5%  THERMISTOR-V-10K-1608  [1608]
RT12  10kΩ 5%  THERMISTOR-V-10K-1608  [1608]
RT13  10kΩ 5%  THERMISTOR-V-10K-1608  [1608]
RT15  10kΩ 5%  THERMISTOR-V-10K-1608  [1608]
TP2  TEST_POINT-SMD-C-1.25  [SMD-C-1.25]
U15  AD7291  [QFN-20-4040]
U20  AD8515  OPAMP-1-AD8515  [SOT23-5]
U21  AD8515  OPAMP-1-AD8515  [SOT23-5]
U22  AD7291  [QFN-20-4040]
U24  AD8515  OPAMP-1-AD8515  [SOT23-5]

### Nets
3.3V_2 [Power]: C48.1 C74.1 FB2.1 R18.2 R25.2 U15.11(AS0) U15.13(AS1) U15.16(VDRIVE) U22.13(AS1) U22.16(VDRIVE) ; supply symbol labelled 3.3V-2 ; also sheet 3,4,5,6,8,13
!ADCS_ADC_RESET!: R18.1 R25.1 U15.17(!PD!/!RST) U22.17(!PD!/!RST) ; also sheet 3
ADCS_ADC0_DCAP: C59.1 U15.8(DCAP)
ADCS_ADC0_VREF: C60.1 U15.7(VREF) U20.3(IN+)
ADCS_ADC1_DCAP: C80.1 U22.8(DCAP)
ADCS_ADC1_VREF: C81.1 U22.7(VREF) U24.3(IN+)
ADCS_HALF_REF: U21.1(OUT) U21.4(IN-) ; also sheet 5
ADCS_HALF_REF_UNBUFF: RN3.1(A1) RN3.2(B1) U21.3(IN+)
ADCS_I2C0_SCL: U15.15(SCL) U22.15(SCL) ; also sheet 3,4,6
ADCS_I2C0_SDA: U15.14(SDA) U22.14(SDA) ; also sheet 3,4,6
AGND [Power]: C34.2 C40.C C56.2 C60.2 C63.2 C64.2 C78.2 C81.2 C84.2 RN3.4(A2) RT1.1 RT5.1 RT12.1 RT13.1 RT15.1 U15.6(AGND) U20.2(V-) U21.2(V-) U22.6(AGND) U24.2(V-) ; also sheet 2,3,5,6,8,9,10,11,12
AVDD-0 [Power]: C34.1 C40.A C56.1 C63.1 C64.1 C78.1 C84.1 FB2.2 TP2.1 U15.10(VDD) U20.5(V+) U21.5(V+) U22.10(VDD) U24.5(V+) ; also sheet 5
AVREF-0: RN2.5(C) RN2.10(C) RN3.3(B2) U20.1(OUT) U20.4(IN-)
AVREF-1: RN4.5(C) RN4.10(C) U24.1(OUT) U24.4(IN-)
COIL-X_CURRENT: U15.18(IN0) ; also sheet 5
COIL-Y_CURRENT: U15.19(IN1) ; also sheet 5
COIL-Z_CURRENT: U15.20(IN2) ; also sheet 5
DGND [Power]: C48.2 C59.2 C74.2 C80.2 U15.9(DGND) U15.PAD(DGND) U22.9(DGND) U22.PAD(DGND) ; also sheet 2,3,4,6,8,9,10,11,12,13
TEMP_ADCS: RN2.1 U15.5(IN7) ; also sheet 3
TEMP_GPS: RN2.6 U15.1(IN3) ; also sheet 8
TEMP_H-BRIDGE-X: RN4.9 U22.18(IN0) ; also sheet 5
TEMP_H-BRIDGE-Y: RN4.8 U22.19(IN1) ; also sheet 5
TEMP_H-BRIDGE-Z: RN4.7 U22.20(IN2) ; also sheet 5
TEMP_IMU0: RN2.4 U15.2(IN4) ; also sheet 6
TEMP_IMU1: RN2.3 U15.3(IN5) ; also sheet 6
TEMP_IMU2: RN2.2 U15.4(IN6) ; also sheet 6
TEMP_PCB-0: RN4.6 RT13.2 U22.1(IN3)
TEMP_PCB-1: RN4.4 RT1.2 U22.2(IN4)
TEMP_PCB-2: RN4.3 RT15.2 U22.3(IN5)
TEMP_PCB-3: RN4.2 RT5.2 U22.4(IN6)
TEMP_PCB-4: RN4.1 RT12.2 U22.5(IN7)
Unconnected: RN2.7 RN2.8 RN2.9 U15.12(ALERT) U22.11(AS0) U22.12(ALERT)

### Notes on the sheet
- 5B3> | 5A6>
- 5C3> | 5B6>
- 5D3> | 5C6>
- 8B3> | <3B5 | 7C4> | <3B5
- 6A4> | 7C4>
- 6D1> | 7C4>
- 6C6> | 7C4>
- 3A5> | \ <3B3 | 7C4> | \ <3B3
- <3B3> | <3B3>
- Note:
  Addr = 0x20 | R/!W
- Note:
  Addr = 0x22 | R/!W
- 5B4>  5C4>  5D4>
- CAD Note:
  Decoupling
- CAD Note:
  Decoupling
- <7A4
- <7A4
- <7A4
- <7A4
- <7A4
- CAD Note:
  Place at various locations around the PCB

## Sheet 8 of 14
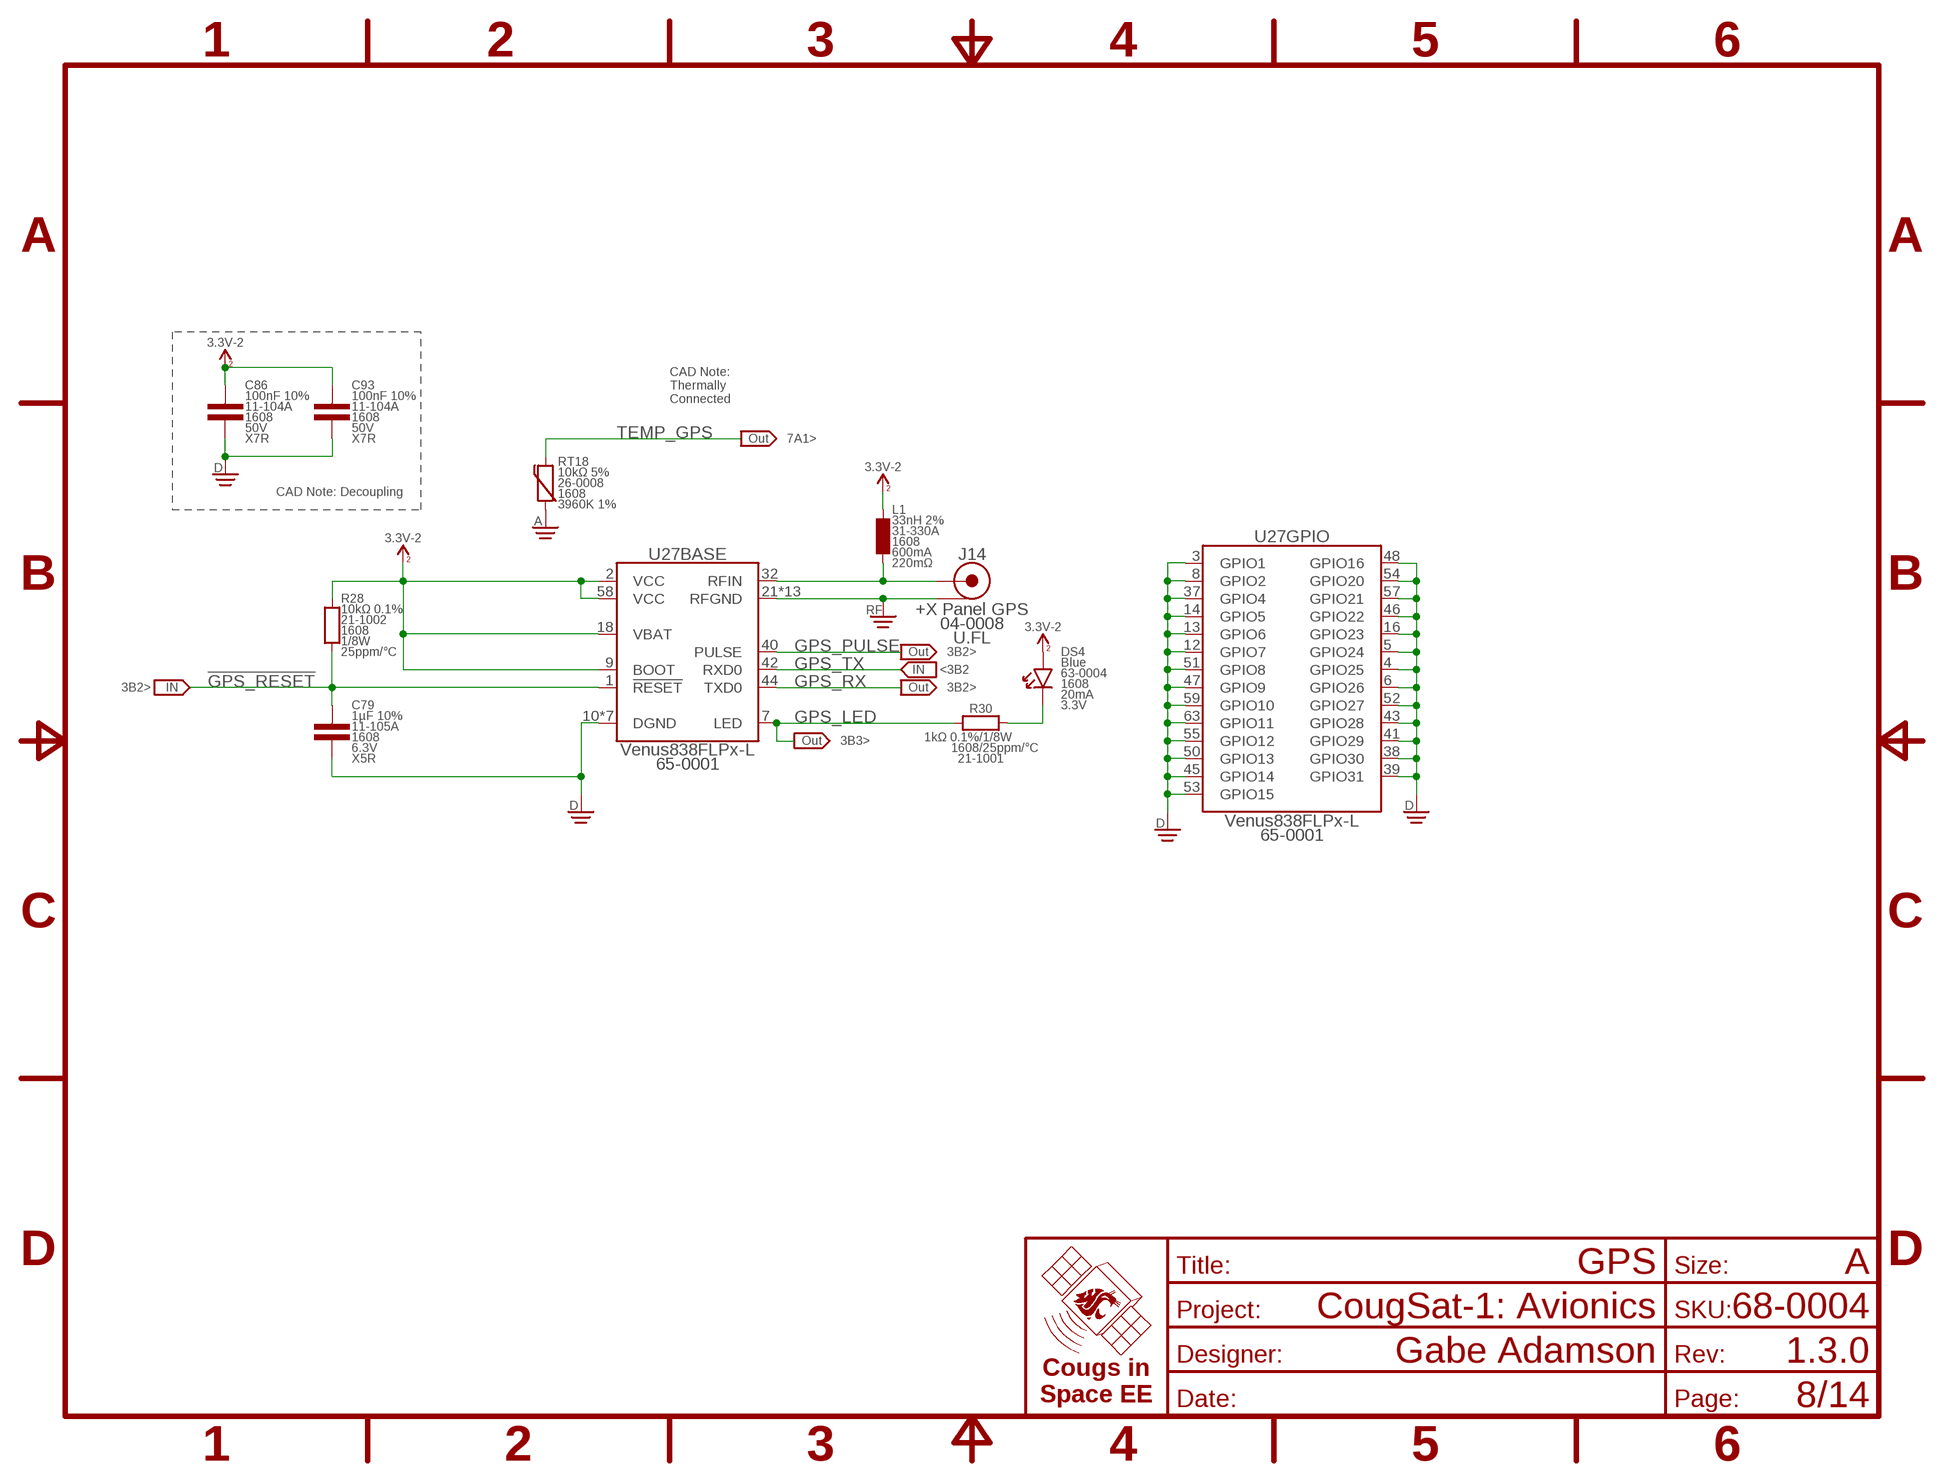
[diagram p7: schematic, sheet 8]
FRAME7 (FRAME-A): TITLE: GPS

### Parts
C79  1µF 10%  CAP-V-1UF-1608  [1608]
C86  100nF 10%  CAP-V-100NF-1608  [1608]
C93  100nF 10%  CAP-V-100NF-1608  [1608]
DS4  Blue  LED-V-BLU-1608  [1608-POL]
J14  +X Panel GPS  COAX-U.FL  [U.FL]
L1  33nH 2%  INDUCTOR-V-33NH-1608  [1608]
R28  10kΩ 0.1%  RES-V-10K-1608  [1608]
R30  1kΩ 0.1%  RES-H-1K-1608  [1608]
RT18  10kΩ 5%  THERMISTOR-V-10K-1608  [1608]
U27  Venus838FLPx-L  VENUS838FLPX  [VENUS-1010]

### Nets
3.3V_2 [Power]: C86.1 C93.1 DS4.A L1.2 R28.2 U27.2(BASE:VCC) U27.9(BASE:BOOT) U27.18(BASE:VBAT) U27.58(BASE:VCC) ; supply symbol labelled 3.3V-2 ; also sheet 3,4,5,6,7,13
!GPS_RESET: C79.1 R28.1 U27.1(BASE:!RESET) ; also sheet 3
AGND [Power]: RT18.1 ; also sheet 2,3,5,6,7,9,10,11,12
DGND [Power]: C79.2 C86.2 C93.2 U27.3(GPIO:GPIO1) U27.4(GPIO:GPIO25) U27.5(GPIO:GPIO24) U27.6(GPIO:GPIO26) U27.8(GPIO:GPIO2) U27.10(BASE:DGND) U27.11(BASE:DGND) U27.12(GPIO:GPIO7) U27.13(GPIO:GPIO6) U27.14(GPIO:GPIO5) U27.15(BASE:DGND) U27.16(GPIO:GPIO23) U27.19(BASE:DGND) U27.37(GPIO:GPIO4) U27.38(GPIO:GPIO30) U27.39(GPIO:GPIO31) U27.41(GPIO:GPIO29) U27.43(GPIO:GPIO28) U27.45(GPIO:GPIO14) U27.46(GPIO:GPIO22) U27.47(GPIO:GPIO9) U27.48(GPIO:GPIO16) U27.49(BASE:DGND) U27.50(GPIO:GPIO13) U27.51(GPIO:GPIO8) U27.52(GPIO:GPIO27) U27.53(GPIO:GPIO15) U27.54(GPIO:GPIO20) U27.55(GPIO:GPIO12) U27.57(GPIO:GPIO21) U27.59(GPIO:GPIO10) U27.60(BASE:DGND) U27.63(GPIO:GPIO11) U27.64(BASE:DGND) ; also sheet 2,3,4,6,7,9,10,11,12,13
GPS_LED: R30.1 U27.7(BASE:LED) ; also sheet 3
GPS_LED_DIODE: DS4.C R30.2
GPS_PULSE: U27.40(BASE:PULSE) ; also sheet 3
GPS_RFIN: J14.CENTER L1.1 U27.32(BASE:RFIN)
GPS_RX: U27.44(BASE:TXD0) ; also sheet 3
GPS_TX: U27.42(BASE:RXD0) ; also sheet 3
RFGND [Power]: J14.SHIELD@1(SHIELD) J14.SHIELD@2(SHIELD) J14.SHIELD@13(SHIELD) U27.21(BASE:RFGND) U27.22(BASE:RFGND) U27.24(BASE:RFGND) U27.25(BASE:RFGND) U27.27(BASE:RFGND) U27.28(BASE:RFGND) U27.29(BASE:RFGND) U27.31(BASE:RFGND) U27.33(BASE:RFGND) U27.61(BASE:RFGND) U27.62(BASE:RFGND) U27.65(BASE:RFGND) U27.69(BASE:RFGND) ; also sheet 2
TEMP_GPS: RT18.2 ; also sheet 7

### Notes on the sheet
- CAD Note:
  Thermally
  Connected
- 7A1>
- CAD Note: Decoupling
- 3B2>
- <3B2
- 3B2> | 3B2>
- 3B3>

## Sheet 9 of 14
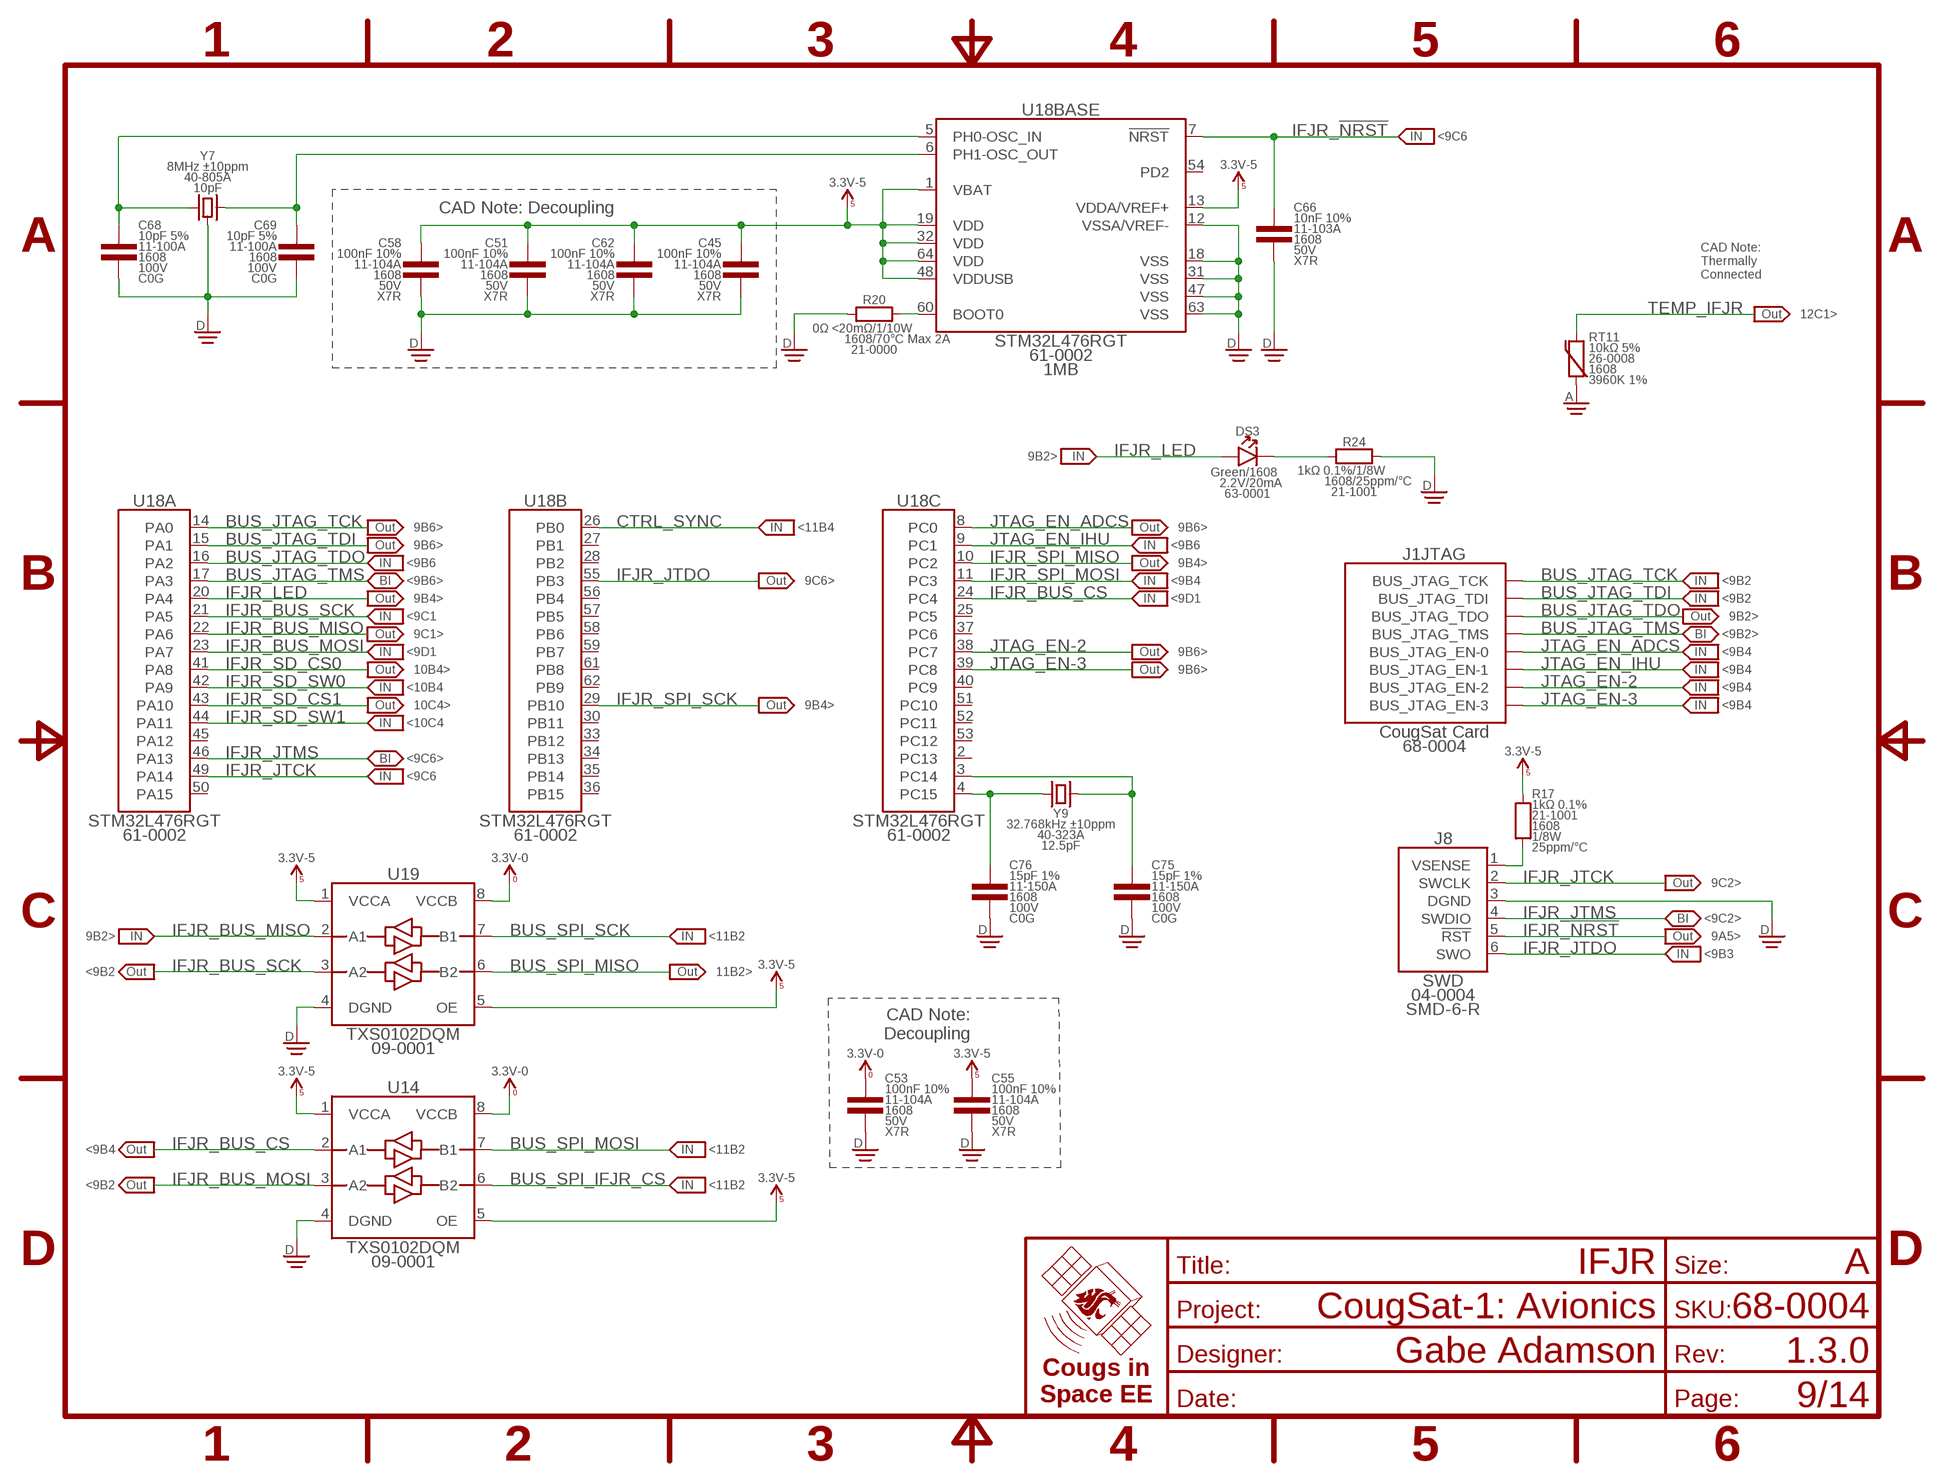
[diagram p8: schematic, sheet 9]
FRAME8 (FRAME-A): TITLE: IFJR

### Parts
C45  100nF 10%  CAP-V-100NF-1608  [1608]
C51  100nF 10%  CAP-V-100NF-1608  [1608]
C53  100nF 10%  CAP-V-100NF-1608  [1608]
C55  100nF 10%  CAP-V-100NF-1608  [1608]
C58  100nF 10%  CAP-V-100NF-1608  [1608]
C62  100nF 10%  CAP-V-100NF-1608  [1608]
C66  10nF 10%  CAP-V-10NF-1608  [1608]
C68  10pF 5%  CAP-V-10PF-1608  [1608]
C69  10pF 5%  CAP-V-10PF-1608  [1608]
C75  15pF 1%  CAP-V-15PF-1608  [1608]
C76  15pF 1%  CAP-V-15PF-1608  [1608]
DS3  Green  LED-H-GRN-1608  [1608-POL]
J1  CougSat Card  CIS_CARD  [CARD-FULL]
J8  SWD  SWDSMD-6-R  [SMD2.54-1X06-R]
R17  1kΩ 0.1%  RES-V-1K-1608  [1608]
R20  0Ω <20mΩ  RES-H-0-1608  [1608]
R24  1kΩ 0.1%  RES-H-1K-1608  [1608]
RT11  10kΩ 5%  THERMISTOR-V-10K-1608  [1608]
U14  TXS0102DQM  LEVEL_SHIFTER-2BIT-XSON-8  [X2SON-8]
U18  STM32L476RGT  STM32-64P-L476RGT  [QFP-64-1010]
U19  TXS0102DQM  LEVEL_SHIFTER-2BIT-XSON-8  [X2SON-8]
Y7  8MHz ±10ppm  CRYSTAL-GROUNDED-8M-SMD-5032  [SMD-5032]
Y9  32.768kHz ±10ppm  CRYSTAL-32.768K-SMD-3215  [SMD-3215]

### Nets
3.3V_0 [Power]: C53.1 U14.8(VCCB) U19.8(VCCB) ; supply symbol labelled 3.3V-0 ; also sheet 3,11,12,13
3.3V_5 [Power]: C45.1 C51.1 C55.1 C58.1 C62.1 R17.2 U14.1(VCCA) U14.5(OE) U18.1(BASE:VBAT) U18.13(BASE:VDDA/VREF+) U18.19(BASE:VDD) U18.32(BASE:VDD) U18.48(BASE:VDDUSB) U18.64(BASE:VDD) U19.1(VCCA) U19.5(OE) ; supply symbol labelled 3.3V-5 ; also sheet 3,10,11,13
AGND [Power]: RT11.1 ; also sheet 2,3,5,6,7,8,10,11,12
BUS_JTAG_TCK: J1.A46(JTAG:BUS_JTAG_TCK) U18.14(A:PA0) ; also sheet 3,11
BUS_JTAG_TDI: J1.A47(JTAG:BUS_JTAG_TDI) U18.15(A:PA1) ; also sheet 3,11
BUS_JTAG_TDO: J1.A48(JTAG:BUS_JTAG_TDO) U18.16(A:PA2) ; also sheet 3,11
BUS_JTAG_TMS: J1.A49(JTAG:BUS_JTAG_TMS) U18.17(A:PA3) ; also sheet 3,11
BUS_SPI_IFJR_CS: U14.6(B2) ; also sheet 11
BUS_SPI_MISO: U19.6(B2) ; also sheet 11
BUS_SPI_MOSI: U14.7(B1) ; also sheet 11
BUS_SPI_SCK: U19.7(B1) ; also sheet 11
CTRL_SYNC: U18.26(B:PB0) ; also sheet 3,11
DGND [Power]: C45.2 C51.2 C53.2 C55.2 C58.2 C62.2 C66.2 C68.2 C69.2 C75.2 C76.2 J8.3(DGND) R20.1 R24.2 U14.4(DGND) U18.12(BASE:VSSA/VREF-) U18.18(BASE:VSS) U18.31(BASE:VSS) U18.47(BASE:VSS) U18.63(BASE:VSS) U19.4(DGND) Y7.2(GND) Y7.4(GND) ; also sheet 2,3,4,6,7,8,10,11,12,13
IFJR_!NRST: C66.1 J8.5(!RST) U18.7(BASE:!NRST)
IFJR_BOOT0: R20.2 U18.60(BASE:BOOT0)
IFJR_BUS_CS: U14.2(A1) U18.24(C:PC4)
IFJR_BUS_MISO: U18.22(A:PA6) U19.2(A1)
IFJR_BUS_MOSI: U14.3(A2) U18.23(A:PA7)
IFJR_BUS_SCK: U18.21(A:PA5) U19.3(A2)
IFJR_JTCK: J8.2(SWCLK) U18.49(A:PA14)
IFJR_JTDO: J8.6(SWO) U18.55(B:PB3)
IFJR_JTMS: J8.4(SWDIO) U18.46(A:PA13)
IFJR_LED: DS3.A U18.20(A:PA4)
IFJR_LED_GND: DS3.C R24.1
IFJR_OSC_32_IN: C76.1 U18.4(C:PC15) Y9.1
IFJR_OSC_32_OUT: C75.1 U18.3(C:PC14) Y9.2
IFJR_OSC_IN: C68.1 U18.5(BASE:PH0-OSC_IN) Y7.1
IFJR_OSC_OUT: C69.1 U18.6(BASE:PH1-OSC_OUT) Y7.3
IFJR_SD_CS0: U18.41(A:PA8) ; also sheet 10
IFJR_SD_CS1: U18.43(A:PA10) ; also sheet 10
IFJR_SD_SW0: U18.42(A:PA9) ; also sheet 10
IFJR_SD_SW1: U18.44(A:PA11) ; also sheet 10
IFJR_SPI_MISO: U18.10(C:PC2) ; also sheet 10
IFJR_SPI_MOSI: U18.11(C:PC3) ; also sheet 10
IFJR_SPI_SCK: U18.29(B:PB10) ; also sheet 10
IFJR_SWD_VSENSE: J8.1(VSENSE) R17.1
JTAG_EN-2: J1.B48(JTAG:BUS_JTAG_EN-2) U18.38(C:PC7)
JTAG_EN-3: J1.B49(JTAG:BUS_JTAG_EN-3) U18.39(C:PC8)
JTAG_EN_ADCS: J1.B46(JTAG:BUS_JTAG_EN-0) U18.8(C:PC0) ; also sheet 3
JTAG_EN_IHU: J1.B47(JTAG:BUS_JTAG_EN-1) U18.9(C:PC1) ; also sheet 11
TEMP_IFJR: RT11.2 ; also sheet 12
Unconnected: U18.2(C:PC13) U18.25(C:PC5) U18.27(B:PB1) U18.28(B:PB2) U18.30(B:PB11) U18.33(B:PB12) U18.34(B:PB13) U18.35(B:PB14) U18.36(B:PB15) U18.37(C:PC6) U18.40(C:PC9) U18.45(A:PA12) U18.50(A:PA15) U18.51(C:PC10) U18.52(C:PC11) U18.53(C:PC12) U18.54(BASE:EXTRA_PIN) U18.56(B:PB4) U18.57(B:PB5) U18.58(B:PB6) U18.59(B:PB7) U18.61(B:PB8) U18.62(B:PB9)

### Notes on the sheet
- <9C6
- CAD Note: Decoupling
- CAD Note:
  Thermally
  Connected
- 12C1>
- 9B2>
- 9B6> | <11B4 | 9B6>
- 9B6> | <9B6
- <9B6 | 9B4>
- <9B6> | 9C6> | <9B4 | <9B2
- 9B4> | <9D1 | <9B2
- <9C1 | 9B2>
- 9C1> | <9B2>
- <9D1 | 9B6> | <9B4
- 10B4> | 9B6> | <9B4
- <10B4 | <9B4
- 10C4> | 9B4> | <9B4
- <10C4
- <9C6>
- <9C6
- 9C2>
- <9C2>
- 9B2> | <11B2 | 9A5>
- <9B3
- <9B2 | 11B2>
- CAD Note:
  Decoupling
- <9B4 | <11B2
- <9B2 | <11B2

## Sheet 10 of 14
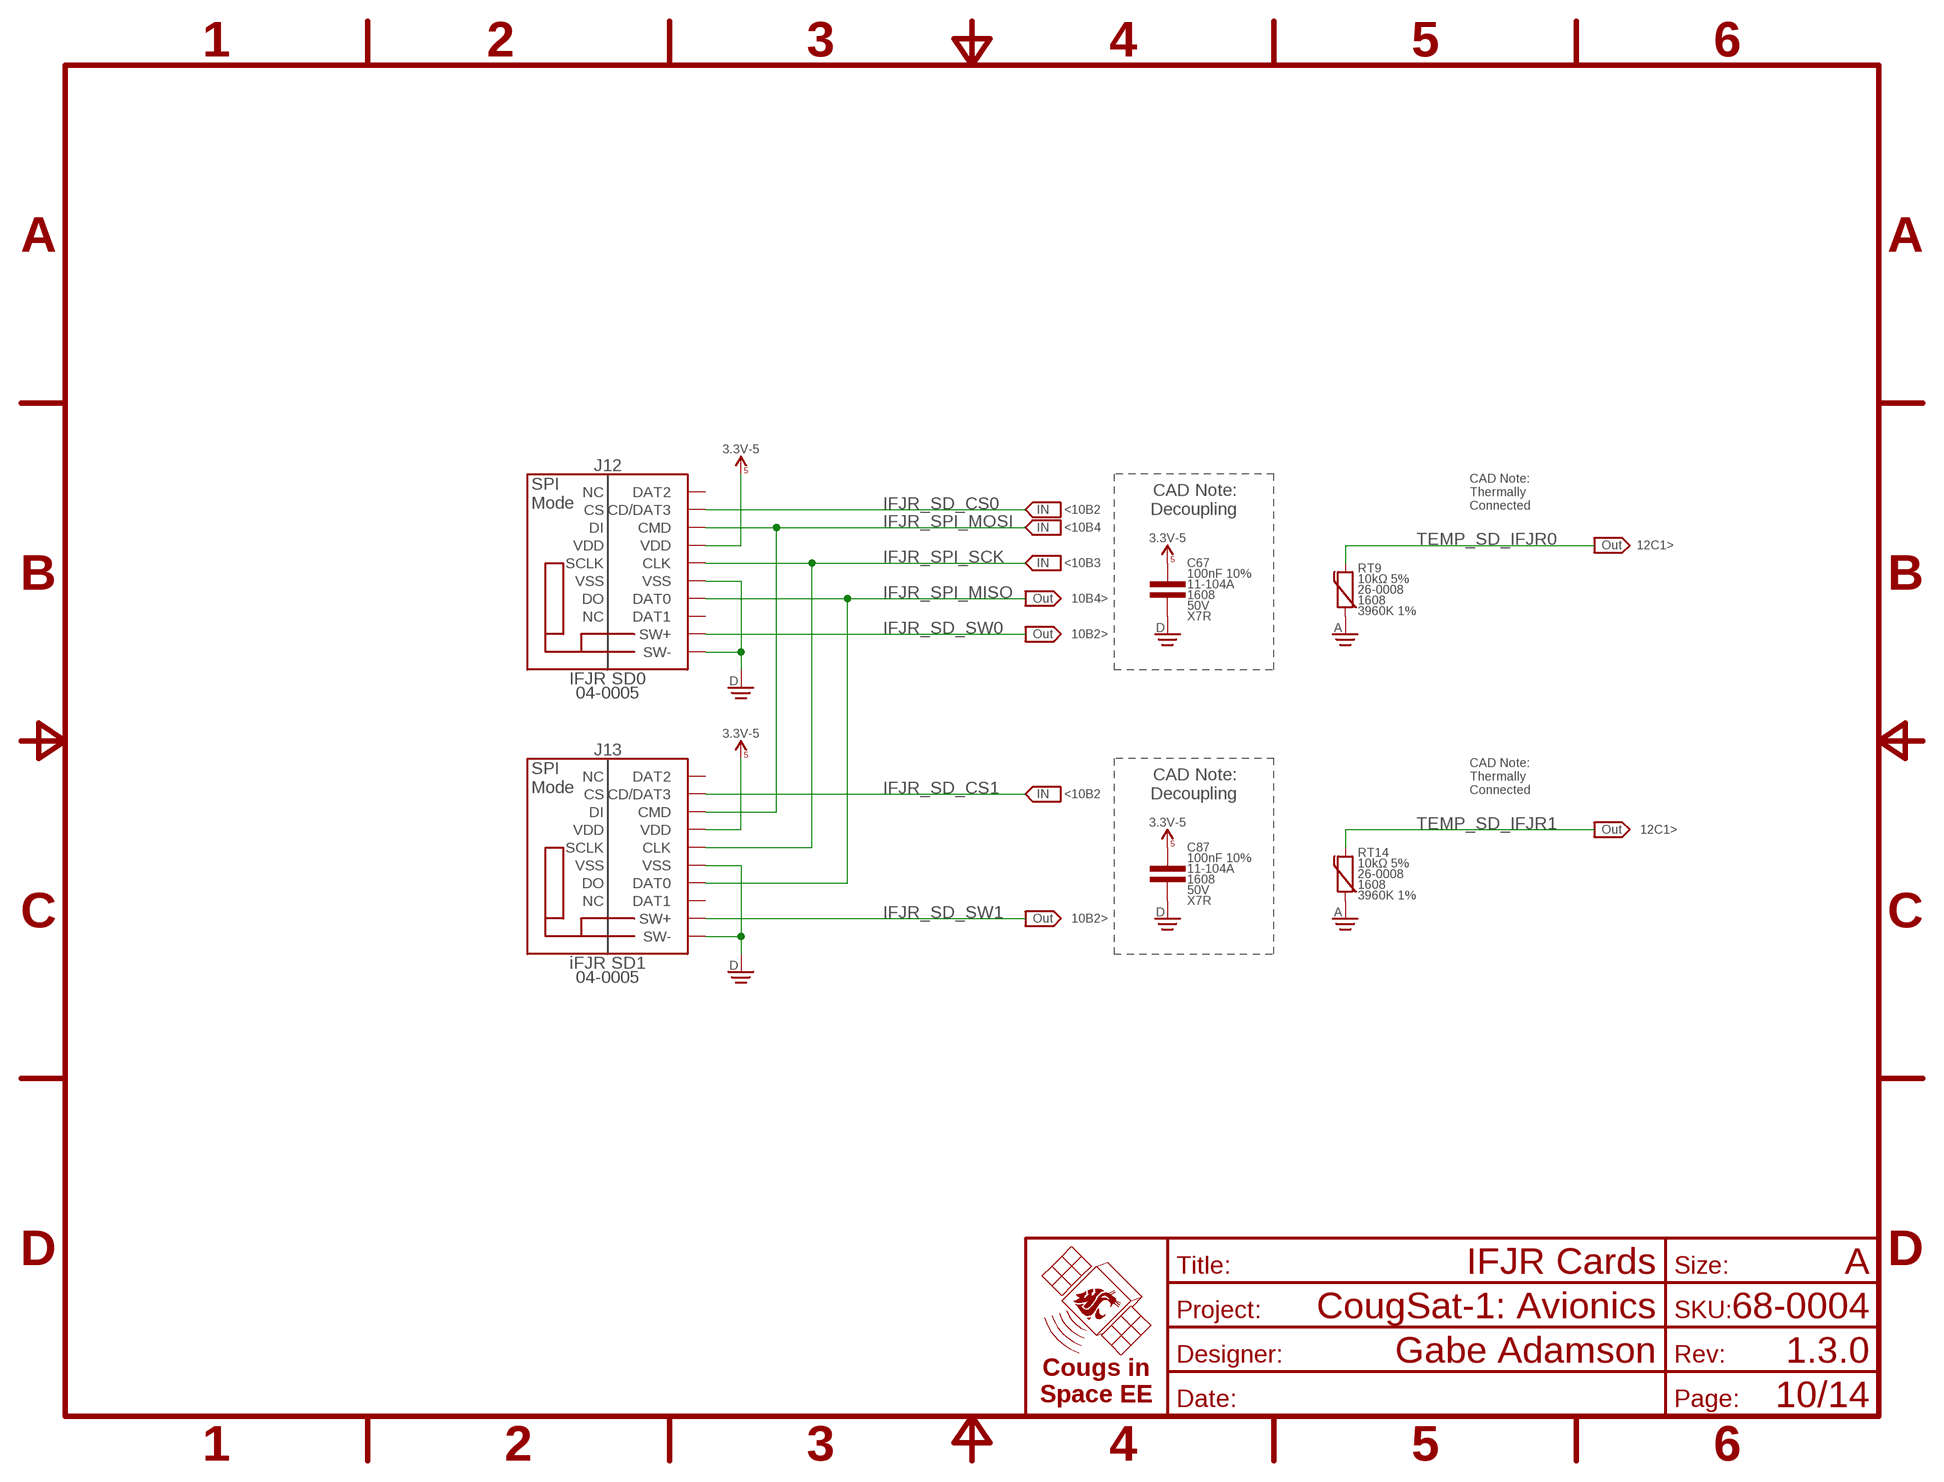
[diagram p9: schematic, sheet 10]
FRAME14 (FRAME-A): TITLE: IFJR Cards

### Parts
C67  100nF 10%  CAP-V-100NF-1608  [1608]
C87  100nF 10%  CAP-V-100NF-1608  [1608]
J12  IFJR SD0  µSD-SW-PUSH-PUSH  [µSD-PUSH-PUSH]
J13  iFJR SD1  µSD-SW-PUSH-PUSH  [µSD-PUSH-PUSH]
RT9  10kΩ 5%  THERMISTOR-V-10K-1608  [1608]
RT14  10kΩ 5%  THERMISTOR-V-10K-1608  [1608]

### Nets
3.3V_5 [Power]: C67.1 C87.1 J12.VDD J13.VDD ; supply symbol labelled 3.3V-5 ; also sheet 3,9,11,13
AGND [Power]: RT9.1 RT14.1 ; also sheet 2,3,5,6,7,8,9,11,12
DGND [Power]: C67.2 C87.2 J12.SW-LEVER(SW-) J12.VSS J13.SW-LEVER(SW-) J13.VSS ; also sheet 2,3,4,6,7,8,9,11,12,13
IFJR_SD_CS0: J12.CD/DAT3 ; also sheet 9
IFJR_SD_CS1: J13.CD/DAT3 ; also sheet 9
IFJR_SD_SW0: J12.SW(SW+) ; also sheet 9
IFJR_SD_SW1: J13.SW(SW+) ; also sheet 9
IFJR_SPI_MISO: J12.DAT0 J13.DAT0 ; also sheet 9
IFJR_SPI_MOSI: J12.CMD J13.CMD ; also sheet 9
IFJR_SPI_SCK: J12.CLK J13.CLK ; also sheet 9
TEMP_SD_IFJR0: RT9.2 ; also sheet 12
TEMP_SD_IFJR1: RT14.2 ; also sheet 12
Unconnected: J12.DAT1 J12.DAT2 J13.DAT1 J13.DAT2

### Notes on the sheet
- CAD Note:
  Thermally
  Connected
- <10B2
- CAD Note:
  Decoupling
- <10B4
- 12C1>
- <10B3
- 10B4>
- 10B2>
- CAD Note:
  Thermally
  Connected
- <10B2
- CAD Note:
  Decoupling
- 12C1>
- 10B2>

## Sheet 11 of 14
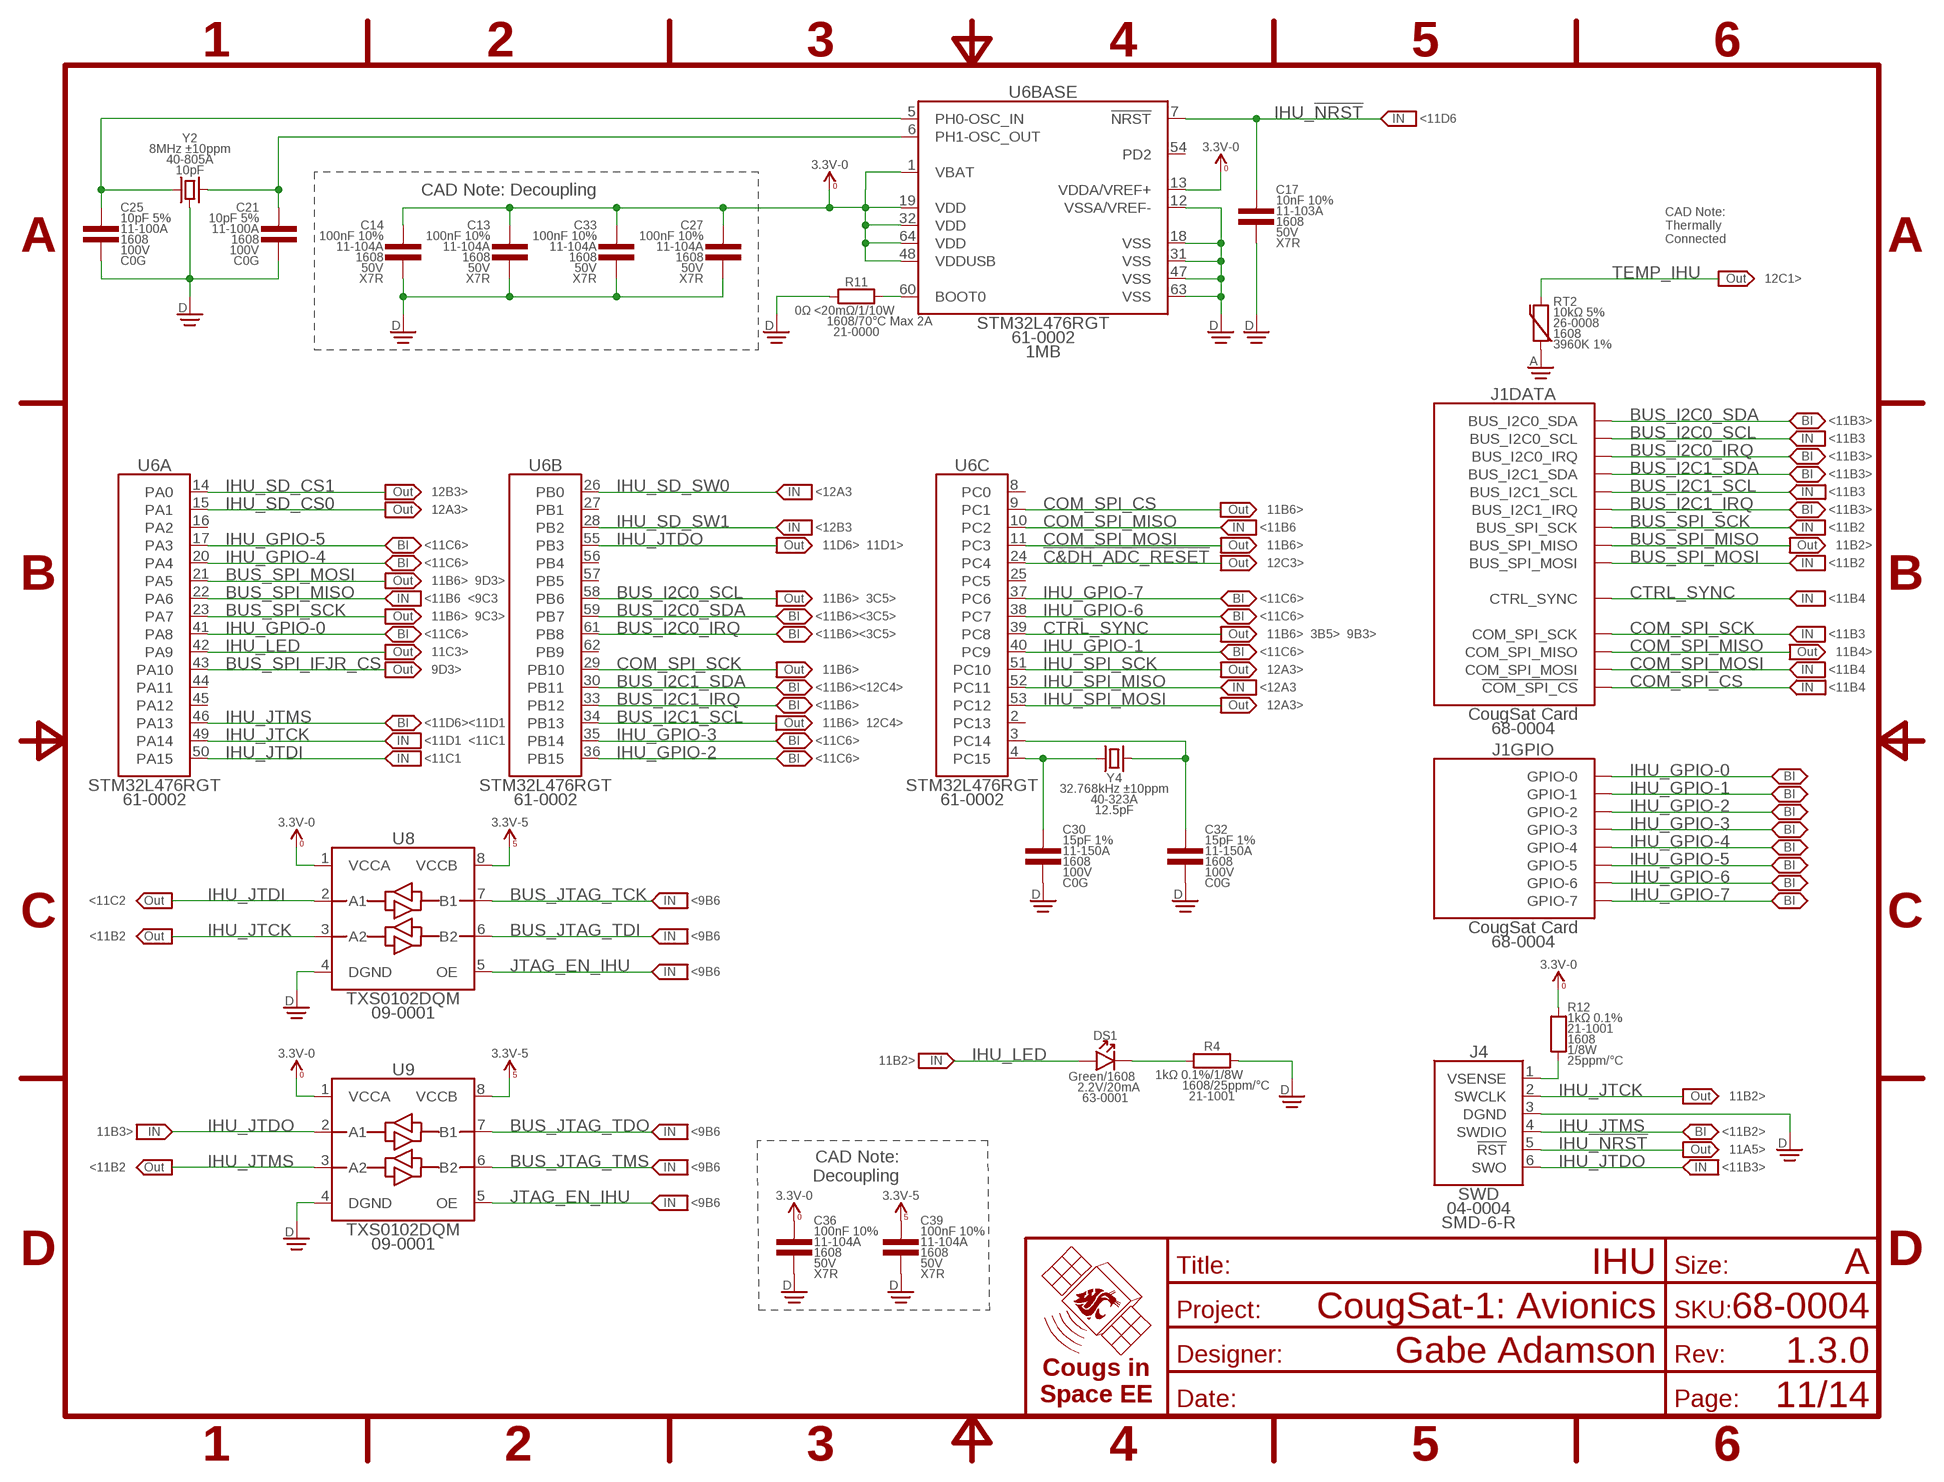
[diagram p10: schematic, sheet 11]
FRAME9 (FRAME-A): TITLE: IHU

### Parts
C13  100nF 10%  CAP-V-100NF-1608  [1608]
C14  100nF 10%  CAP-V-100NF-1608  [1608]
C17  10nF 10%  CAP-V-10NF-1608  [1608]
C21  10pF 5%  CAP-V-10PF-1608  [1608]
C25  10pF 5%  CAP-V-10PF-1608  [1608]
C27  100nF 10%  CAP-V-100NF-1608  [1608]
C30  15pF 1%  CAP-V-15PF-1608  [1608]
C32  15pF 1%  CAP-V-15PF-1608  [1608]
C33  100nF 10%  CAP-V-100NF-1608  [1608]
C36  100nF 10%  CAP-V-100NF-1608  [1608]
C39  100nF 10%  CAP-V-100NF-1608  [1608]
DS1  Green  LED-H-GRN-1608  [1608-POL]
J4  SWD  SWDSMD-6-R  [SMD2.54-1X06-R]
R4  1kΩ 0.1%  RES-H-1K-1608  [1608]
R11  0Ω <20mΩ  RES-H-0-1608  [1608]
R12  1kΩ 0.1%  RES-V-1K-1608  [1608]
RT2  10kΩ 5%  THERMISTOR-V-10K-1608  [1608]
U6  STM32L476RGT  STM32-64P-L476RGT  [QFP-64-1010]
U8  TXS0102DQM  LEVEL_SHIFTER-2BIT-XSON-8  [X2SON-8]
U9  TXS0102DQM  LEVEL_SHIFTER-2BIT-XSON-8  [X2SON-8]
Y2  8MHz ±10ppm  CRYSTAL-GROUNDED-8M-SMD-5032  [SMD-5032]
Y4  32.768kHz ±10ppm  CRYSTAL-32.768K-SMD-3215  [SMD-3215]

### Nets
3.3V_0 [Power]: C13.1 C14.1 C27.1 C33.1 C36.1 R12.2 U6.1(BASE:VBAT) U6.13(BASE:VDDA/VREF+) U6.19(BASE:VDD) U6.32(BASE:VDD) U6.48(BASE:VDDUSB) U6.64(BASE:VDD) U8.1(VCCA) U9.1(VCCA) ; supply symbol labelled 3.3V-0 ; also sheet 3,9,12,13
3.3V_5 [Power]: C39.1 U8.8(VCCB) U9.8(VCCB) ; supply symbol labelled 3.3V-5 ; also sheet 3,9,10,13
!C&DH_ADC_RESET: U6.24(C:PC4) ; also sheet 12
AGND [Power]: RT2.1 ; also sheet 2,3,5,6,7,8,9,10,12
BUS_I2C0_IRQ: J1.A45(DATA:BUS_I2C0_IRQ) J1.B45(DATA:BUS_I2C0_IRQ) U6.61(B:PB8) ; also sheet 3
BUS_I2C0_SCL: J1.A44(DATA:BUS_I2C0_SCL) J1.B44(DATA:BUS_I2C0_SCL) U6.58(B:PB6) ; also sheet 3
BUS_I2C0_SDA: J1.A43(DATA:BUS_I2C0_SDA) J1.B43(DATA:BUS_I2C0_SDA) U6.59(B:PB7) ; also sheet 3
BUS_I2C1_IRQ: J1.A32(DATA:BUS_I2C1_IRQ) J1.B32(DATA:BUS_I2C1_IRQ) U6.33(B:PB12)
BUS_I2C1_SCL: J1.A31(DATA:BUS_I2C1_SCL) J1.B31(DATA:BUS_I2C1_SCL) U6.34(B:PB13) ; also sheet 12
BUS_I2C1_SDA: J1.A30(DATA:BUS_I2C1_SDA) J1.B30(DATA:BUS_I2C1_SDA) U6.30(B:PB11) ; also sheet 12
BUS_JTAG_TCK: U8.7(B1) ; also sheet 3,9
BUS_JTAG_TDI: U8.6(B2) ; also sheet 3,9
BUS_JTAG_TDO: U9.7(B1) ; also sheet 3,9
BUS_JTAG_TMS: U9.6(B2) ; also sheet 3,9
BUS_SPI_IFJR_CS: U6.43(A:PA10) ; also sheet 9
BUS_SPI_MISO: J1.A38(DATA:BUS_SPI_MISO) J1.B38(DATA:BUS_SPI_MISO) U6.22(A:PA6) ; also sheet 9
BUS_SPI_MOSI: J1.A39(DATA:BUS_SPI_MOSI) J1.B39(DATA:BUS_SPI_MOSI) U6.21(A:PA5) ; also sheet 9
BUS_SPI_SCK: J1.A37(DATA:BUS_SPI_SCK) J1.B37(DATA:BUS_SPI_SCK) U6.23(A:PA7) ; also sheet 9
COM_SPI_CS: J1.A36(DATA:!COM_SPI_CS) J1.B36(DATA:!COM_SPI_CS) U6.9(C:PC1)
COM_SPI_MISO: J1.A34(DATA:COM_SPI_MISO) J1.B34(DATA:COM_SPI_MISO) U6.10(C:PC2)
COM_SPI_MOSI: J1.A35(DATA:COM_SPI_MOSI) J1.B35(DATA:COM_SPI_MOSI) U6.11(C:PC3)
COM_SPI_SCK: J1.A33(DATA:COM_SPI_SCK) J1.B33(DATA:COM_SPI_SCK) U6.29(B:PB10)
CTRL_SYNC: J1.A42(DATA:CTRL_SYNC) J1.B42(DATA:CTRL_SYNC) U6.39(C:PC8) ; also sheet 3,9
DGND [Power]: C13.2 C14.2 C17.2 C21.2 C25.2 C27.2 C30.2 C32.2 C33.2 C36.2 C39.2 J4.3(DGND) R4.2 R11.1 U6.12(BASE:VSSA/VREF-) U6.18(BASE:VSS) U6.31(BASE:VSS) U6.47(BASE:VSS) U6.63(BASE:VSS) U8.4(DGND) U9.4(DGND) Y2.2(GND) Y2.4(GND) ; also sheet 2,3,4,6,7,8,9,10,12,13
IHU_!NRST: C17.1 J4.5(!RST) U6.7(BASE:!NRST)
IHU_BOOT0: R11.2 U6.60(BASE:BOOT0)
IHU_GPIO-0: J1.A24(GPIO:GPIO-0) U6.41(A:PA8)
IHU_GPIO-1: J1.A25(GPIO:GPIO-1) U6.40(C:PC9)
IHU_GPIO-2: J1.A26(GPIO:GPIO-2) U6.36(B:PB15)
IHU_GPIO-3: J1.A27(GPIO:GPIO-3) U6.35(B:PB14)
IHU_GPIO-4: J1.A28(GPIO:GPIO-4) U6.20(A:PA4)
IHU_GPIO-5: J1.A29(GPIO:GPIO-5) U6.17(A:PA3)
IHU_GPIO-6: J1.A41(GPIO:GPIO-6) U6.38(C:PC7)
IHU_GPIO-7: J1.B41(GPIO:GPIO-7) U6.37(C:PC6)
IHU_JTCK: J4.2(SWCLK) U6.49(A:PA14) U8.3(A2)
IHU_JTDI: U6.50(A:PA15) U8.2(A1)
IHU_JTDO: J4.6(SWO) U6.55(B:PB3) U9.2(A1)
IHU_JTMS: J4.4(SWDIO) U6.46(A:PA13) U9.3(A2)
IHU_LED: DS1.A U6.42(A:PA9)
IHU_LED_GND: DS1.C R4.1
IHU_OSC_32_IN: C30.1 U6.4(C:PC15) Y4.1
IHU_OSC_32_OUT: C32.1 U6.3(C:PC14) Y4.2
IHU_OSC_IN: C25.1 U6.5(BASE:PH0-OSC_IN) Y2.1
IHU_OSC_OUT: C21.1 U6.6(BASE:PH1-OSC_OUT) Y2.3
IHU_SD_CS0: U6.15(A:PA1) ; also sheet 12
IHU_SD_CS1: U6.14(A:PA0) ; also sheet 12
IHU_SD_SW0: U6.26(B:PB0) ; also sheet 12
IHU_SD_SW1: U6.28(B:PB2) ; also sheet 12
IHU_SPI_MISO: U6.52(C:PC11) ; also sheet 12
IHU_SPI_MOSI: U6.53(C:PC12) ; also sheet 12
IHU_SPI_SCK: U6.51(C:PC10) ; also sheet 12
IHU_SWD_VSENSE: J4.1(VSENSE) R12.1
JTAG_EN_IHU: U8.5(OE) U9.5(OE) ; also sheet 9
TEMP_IHU: RT2.2 ; also sheet 12
Unconnected: U6.2(C:PC13) U6.8(C:PC0) U6.16(A:PA2) U6.25(C:PC5) U6.27(B:PB1) U6.44(A:PA11) U6.45(A:PA12) U6.54(BASE:EXTRA_PIN) U6.56(B:PB4) U6.57(B:PB5) U6.62(B:PB9)

### Notes on the sheet
- <11D6
- CAD Note: Decoupling
- CAD Note:
  Thermally
  Connected
- 12C1>
- <11B3>
- <11B3
- <11B3>
- <11B3>
- 12B3> | <12A3 | <11B3
- 12A3> | 11B6> | <11B3>
- <12B3 | <11B6 | <11B2
- <11C6> | 11D6>  11D1> | 11B6> | 11B2>
- <11C6> | 12C3> | <11B2
- 11B6>  9D3>
- <11B6  <9C3 | 11B6>  3C5> | <11C6> | <11B4
- 11B6>  9C3> | <11B6><3C5> | <11C6>
- <11C6> | <11B6><3C5> | 11B6>  3B5>  9B3> | <11B3
- 11C3> | <11C6> | 11B4>
- 9D3> | 11B6> | 12A3> | <11B4
- <11B6><12C4> | <12A3 | <11B4
- <11B6> | 12A3>
- <11D6><11D1 | 11B6>  12C4>
- <11D1  <11C1 | <11C6>
- <11C1 | <11C6>
- <11C2 | <9B6
- <11B2 | <9B6
- <9B6
- 11B2>
- 11B2>
- 11B3> | <9B6 | <11B2>
- 11A5>
- <11B2 | <9B6 | <11B3>
- CAD Note:
  Decoupling
- <9B6

## Sheet 12 of 14
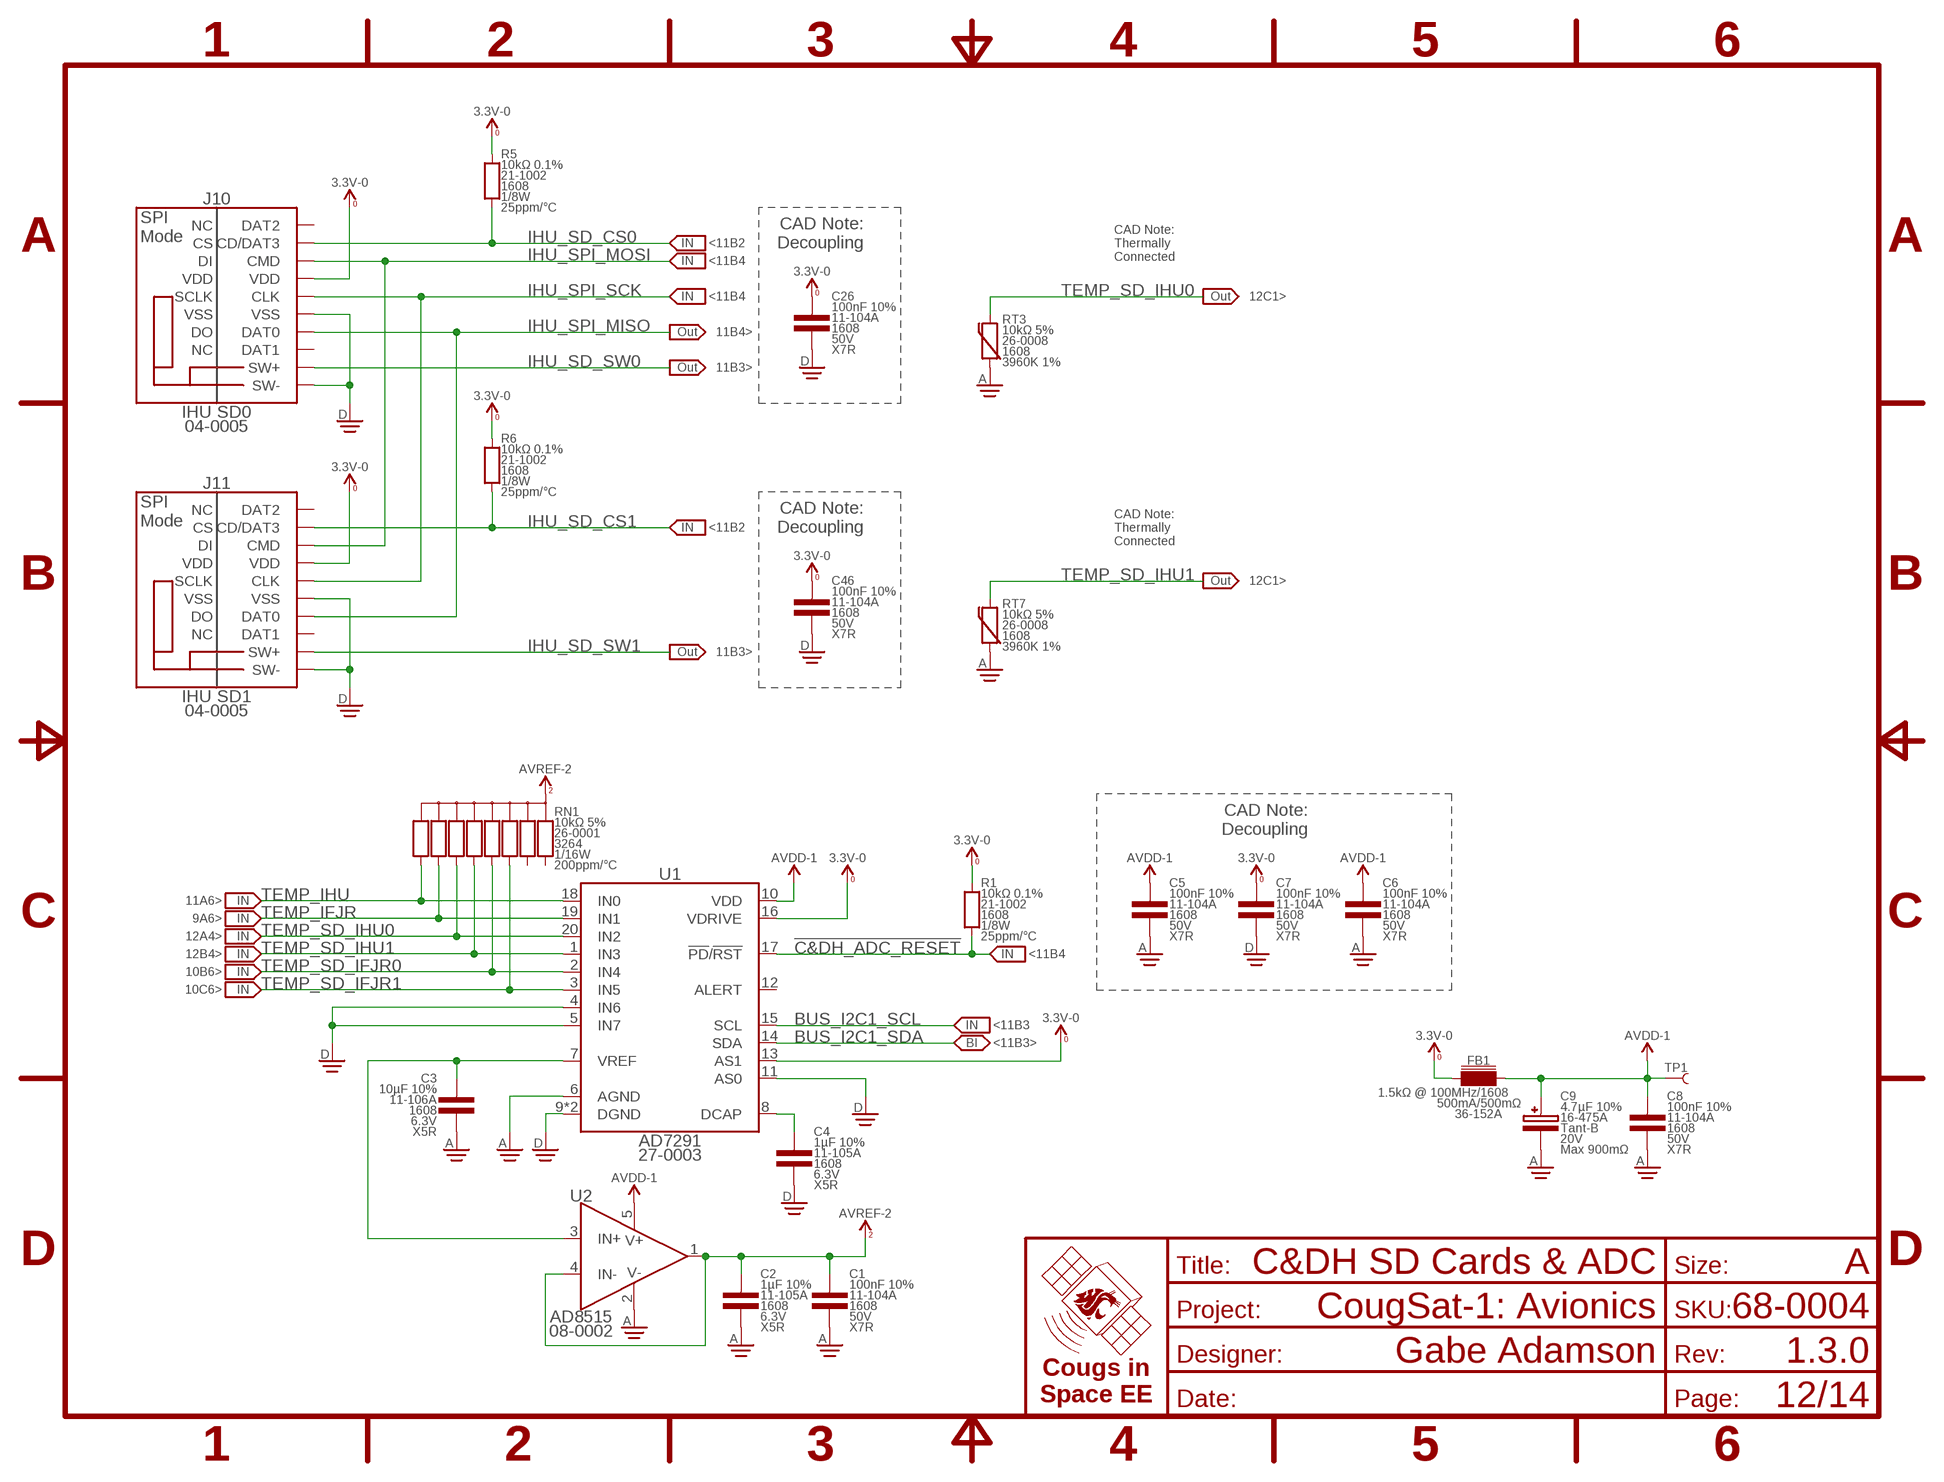
[diagram p11: schematic, sheet 12]
FRAME12 (FRAME-A): TITLE: C&DH SD Cards & ADC

### Parts
C1  100nF 10%  CAP-V-100NF-1608  [1608]
C2  1µF 10%  CAP-V-1UF-1608  [1608]
C3  10µF 10%  CAP-V-10UF-1608  [1608]
C4  1µF 10%  CAP-V-1UF-1608  [1608]
C5  100nF 10%  CAP-V-100NF-1608  [1608]
C6  100nF 10%  CAP-V-100NF-1608  [1608]
C7  100nF 10%  CAP-V-100NF-1608  [1608]
C8  100nF 10%  CAP-V-100NF-1608  [1608]
C9  4.7µF 10%  CAP-POL-V-4.7UF-4028  [4028-POL]
C26  100nF 10%  CAP-V-100NF-1608  [1608]
C46  100nF 10%  CAP-V-100NF-1608  [1608]
FB1  1.5kΩ @ 100MHz  CHOKE-H-1.5K-1608  [1608]
J10  IHU SD0  µSD-SW-PUSH-PUSH  [µSD-PUSH-PUSH]
J11  IHU SD1  µSD-SW-PUSH-PUSH  [µSD-PUSH-PUSH]
R1  10kΩ 0.1%  RES-V-10K-1608  [1608]
R5  10kΩ 0.1%  RES-V-10K-1608  [1608]
R6  10kΩ 0.1%  RES-V-10K-1608  [1608]
RN1  10kΩ 5%  RES_BUS-10-10K-3264  [3264]
RT3  10kΩ 5%  THERMISTOR-V-10K-1608  [1608]
RT7  10kΩ 5%  THERMISTOR-V-10K-1608  [1608]
TP1  TEST_POINT-SMD-C-1.25  [SMD-C-1.25]
U1  AD7291  [QFN-20-4040]
U2  AD8515  OPAMP-1-AD8515  [SOT23-5]

### Nets
3.3V_0 [Power]: C7.1 C26.1 C46.1 FB1.1 J10.VDD J11.VDD R1.2 R5.2 R6.2 U1.13(AS1) U1.16(VDRIVE) ; supply symbol labelled 3.3V-0 ; also sheet 3,9,11,13
!C&DH_ADC_RESET: R1.1 U1.17(!PD!/!RST) ; also sheet 11
AGND [Power]: C1.2 C2.2 C3.2 C5.2 C6.2 C8.2 C9.C RT3.1 RT7.1 U1.6(AGND) U2.2(V-) ; also sheet 2,3,5,6,7,8,9,10,11
AVDD-1 [Power]: C5.1 C6.1 C8.1 C9.A FB1.2 TP1.1 U1.10(VDD) U2.5(V+)
AVREF-2: C1.1 C2.1 RN1.5(C) RN1.10(C) U2.1(OUT) U2.4(IN-)
BUS_I2C1_SCL: U1.15(SCL) ; also sheet 11
BUS_I2C1_SDA: U1.14(SDA) ; also sheet 11
C&DH_ADC_DCAP: C4.1 U1.8(DCAP)
C&DH_ADC_VREF: C3.1 U1.7(VREF) U2.3(IN+)
DGND [Power]: C4.2 C7.2 C26.2 C46.2 J10.SW-LEVER(SW-) J10.VSS J11.SW-LEVER(SW-) J11.VSS U1.4(IN6) U1.5(IN7) U1.9(DGND) U1.11(AS0) U1.PAD(DGND) ; also sheet 2,3,4,6,7,8,9,10,11,13
IHU_SD_CS0: J10.CD/DAT3 R5.1 ; also sheet 11
IHU_SD_CS1: J11.CD/DAT3 R6.1 ; also sheet 11
IHU_SD_SW0: J10.SW(SW+) ; also sheet 11
IHU_SD_SW1: J11.SW(SW+) ; also sheet 11
IHU_SPI_MISO: J10.DAT0 J11.DAT0 ; also sheet 11
IHU_SPI_MOSI: J10.CMD J11.CMD ; also sheet 11
IHU_SPI_SCK: J10.CLK J11.CLK ; also sheet 11
TEMP_IFJR: RN1.8 U1.19(IN1) ; also sheet 9
TEMP_IHU: RN1.9 U1.18(IN0) ; also sheet 11
TEMP_SD_IFJR0: RN1.4 U1.2(IN4) ; also sheet 10
TEMP_SD_IFJR1: RN1.3 U1.3(IN5) ; also sheet 10
TEMP_SD_IHU0: RN1.7 RT3.2 U1.20(IN2)
TEMP_SD_IHU1: RN1.6 RT7.2 U1.1(IN3)
Unconnected: J10.DAT1 J10.DAT2 J11.DAT1 J11.DAT2 RN1.1 RN1.2 U1.12(ALERT)

### Notes on the sheet
- <11B2
- CAD Note:
  Thermally
  Connected
- CAD Note:
  Decoupling
- <11B4
- <11B4 | 12C1>
- 11B4>
- 11B3>
- <11B2
- CAD Note:
  Thermally
  Connected
- CAD Note:
  Decoupling
- 12C1>
- 11B3>
- CAD Note:
  Decoupling
- 11A6>
- 9A6>
- 12A4>
- 12B4> | <11B4
- 10B6>
- 10C6>
- <11B3
- <11B3>

## Sheet 13 of 14
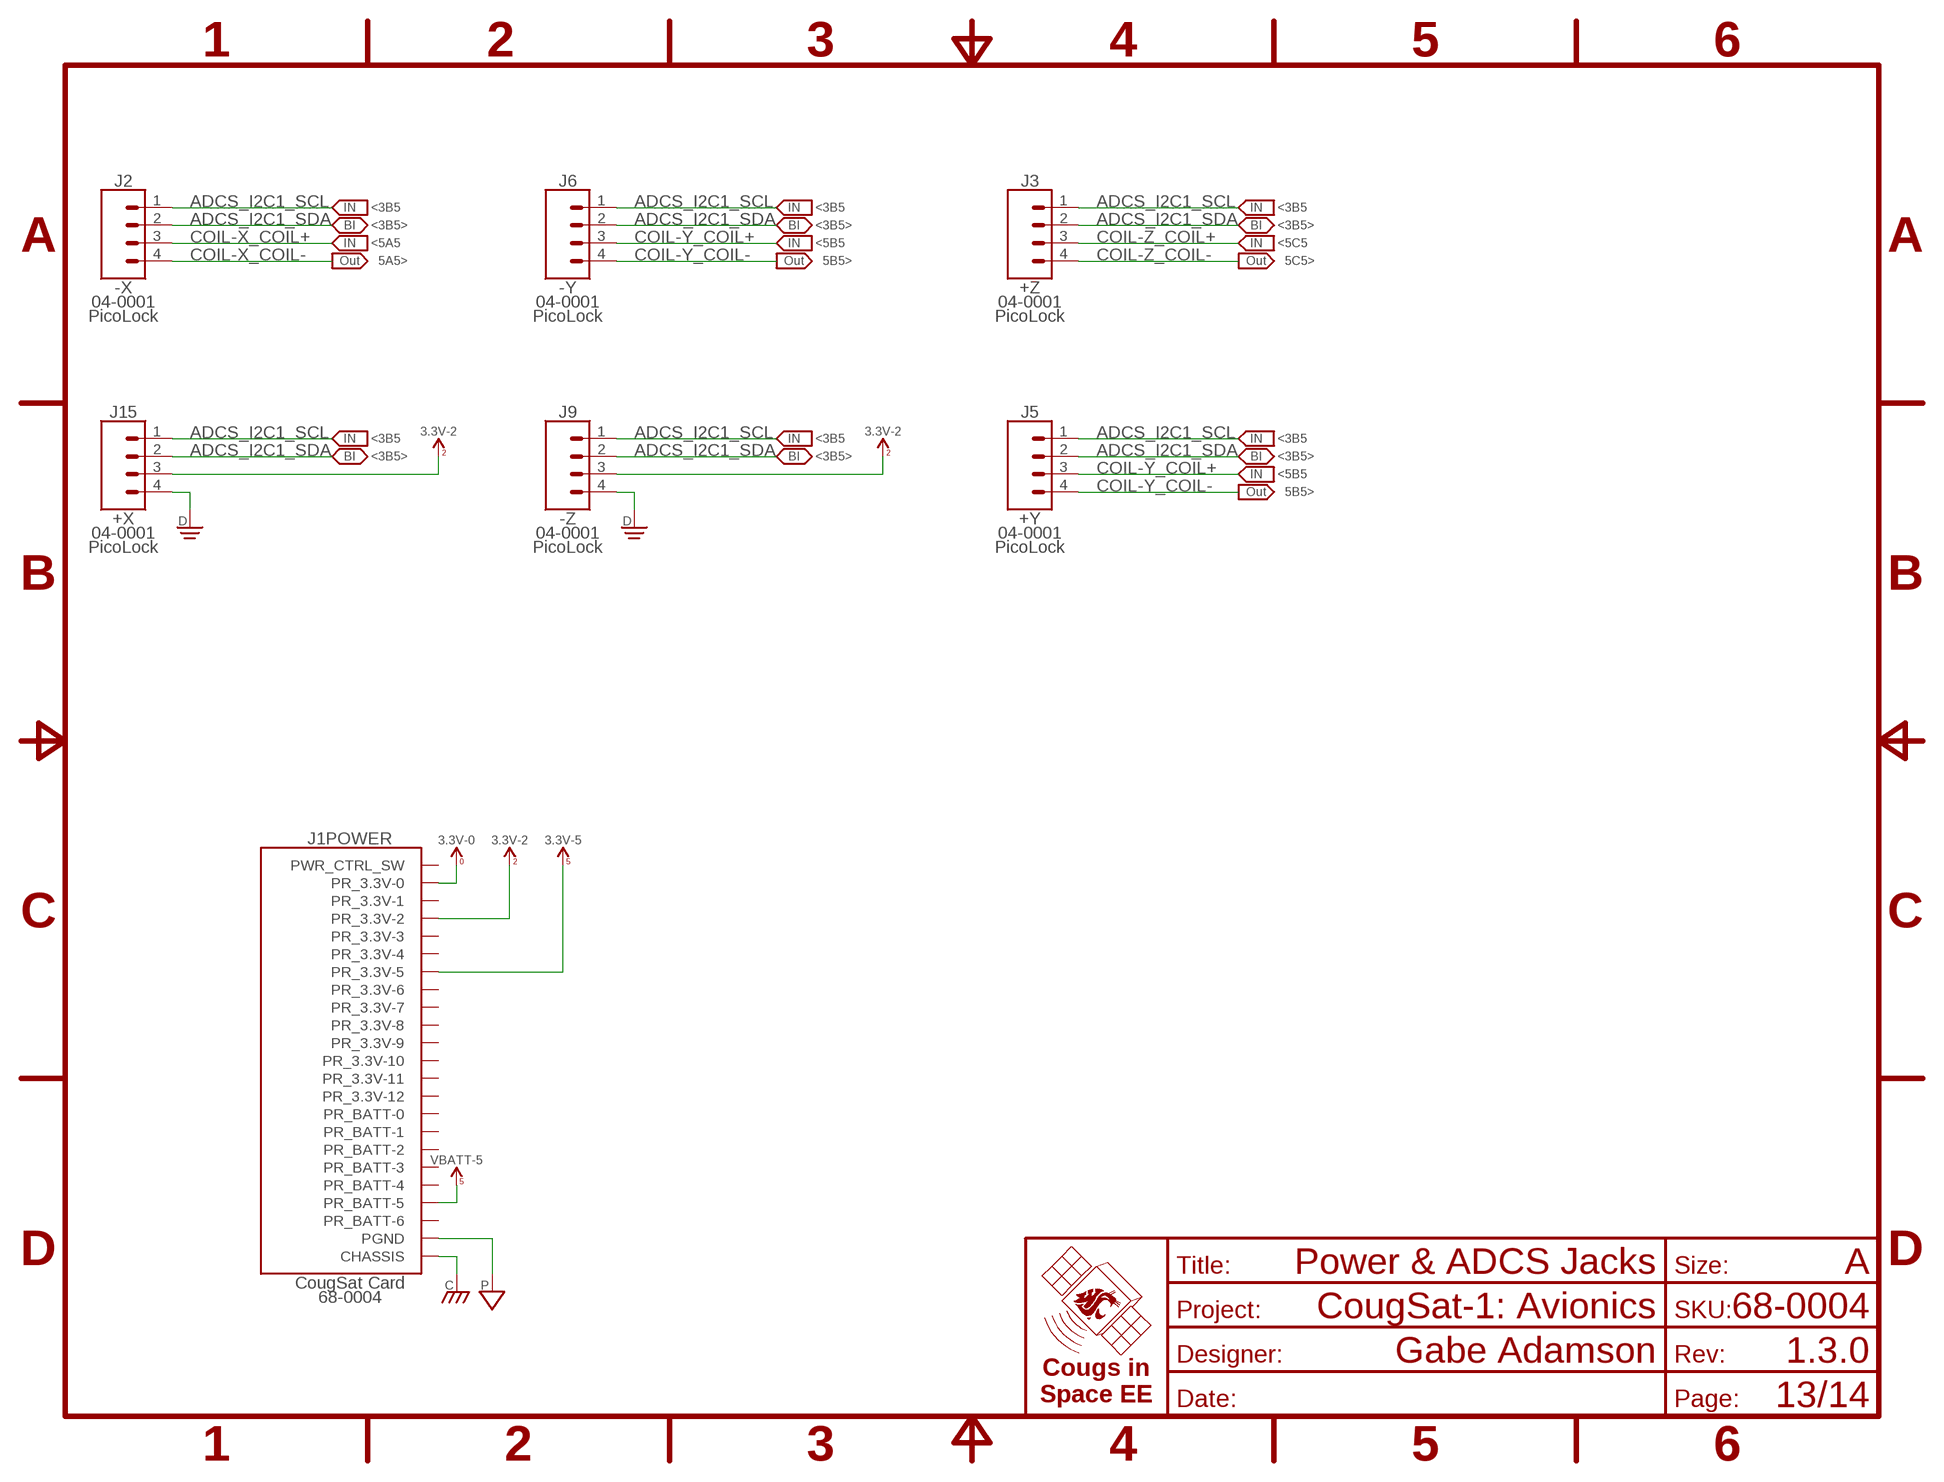
[diagram p12: schematic, sheet 13]
FRAME10 (FRAME-A): TITLE: Power & ADCS Jacks

### Parts
J2  -X  1X04-PICOLOCK  [PICOLOCK1.5-04]
J3  +Z  1X04-PICOLOCK  [PICOLOCK1.5-04]
J5  +Y  1X04-PICOLOCK  [PICOLOCK1.5-04]
J6  -Y  1X04-PICOLOCK  [PICOLOCK1.5-04]
J9  -Z  1X04-PICOLOCK  [PICOLOCK1.5-04]
J15  +X  1X04-PICOLOCK  [PICOLOCK1.5-04]

### Nets
3.3V_0 [Power]: J1.A1(POWER:PR_3.3V-0) J1.B1(POWER:PR_3.3V-0) ; supply symbol labelled 3.3V-0 ; also sheet 3,9,11,12
3.3V_2 [Power]: J1.A3(POWER:PR_3.3V-2) J1.B3(POWER:PR_3.3V-2) J9.3 J15.3 ; supply symbol labelled 3.3V-2 ; also sheet 3,4,5,6,7,8
3.3V_5 [Power]: J1.A6(POWER:PR_3.3V-5) J1.B6(POWER:PR_3.3V-5) ; supply symbol labelled 3.3V-5 ; also sheet 3,9,10,11
ADCS_I2C1_SCL: J2.1 J3.1 J5.1 J6.1 J9.1 J15.1 ; also sheet 3,6
ADCS_I2C1_SDA: J2.2 J3.2 J5.2 J6.2 J9.2 J15.2 ; also sheet 3,6
CHASSIS [Power]: J1.CHASSIS@1(POWER:CHASSIS) J1.CHASSIS@2(POWER:CHASSIS) J1.CHASSIS@3(POWER:CHASSIS) J1.CHASSIS@4(POWER:CHASSIS) ; also sheet 2
COIL-X_COIL+: J2.3 ; also sheet 5
COIL-X_COIL-: J2.4 ; also sheet 5
COIL-Y_COIL+: J5.3 J6.3 ; also sheet 5
COIL-Y_COIL-: J5.4 J6.4 ; also sheet 5
COIL-Z_COIL+: J3.3 ; also sheet 5
COIL-Z_COIL-: J3.4 ; also sheet 5
DGND [Power]: J9.4 J15.4 ; also sheet 2,3,4,6,7,8,9,10,11,12
PGND [Power]: J1.A21(POWER:PGND) J1.A22(POWER:PGND) J1.A23(POWER:PGND) J1.B21(POWER:PGND) J1.B22(POWER:PGND) J1.B23(POWER:PGND) J1.B24(POWER:PGND) J1.B25(POWER:PGND) J1.B26(POWER:PGND) J1.B27(POWER:PGND) J1.B28(POWER:PGND) J1.B29(POWER:PGND) ; also sheet 2,5
VBATT_5 [Power]: J1.A19(POWER:PR_BATT-5) J1.B19(POWER:PR_BATT-5) ; supply symbol labelled VBATT-5 ; also sheet 5
Unconnected: J1.A40(POWER:PWR_CTRL_SW) J1.B40(POWER:PWR_CTRL_SW)

### Notes on the sheet
- <3B5 | <3B5 | <3B5
- <3B5> | <3B5> | <3B5>
- <5A5 | <5B5 | <5C5
- 5A5> | 5B5> | 5C5>
- <3B5 | <3B5 | <3B5
- <3B5> | <3B5> | <3B5>
- <5B5
- 5B5>

## Sheet 14 of 14
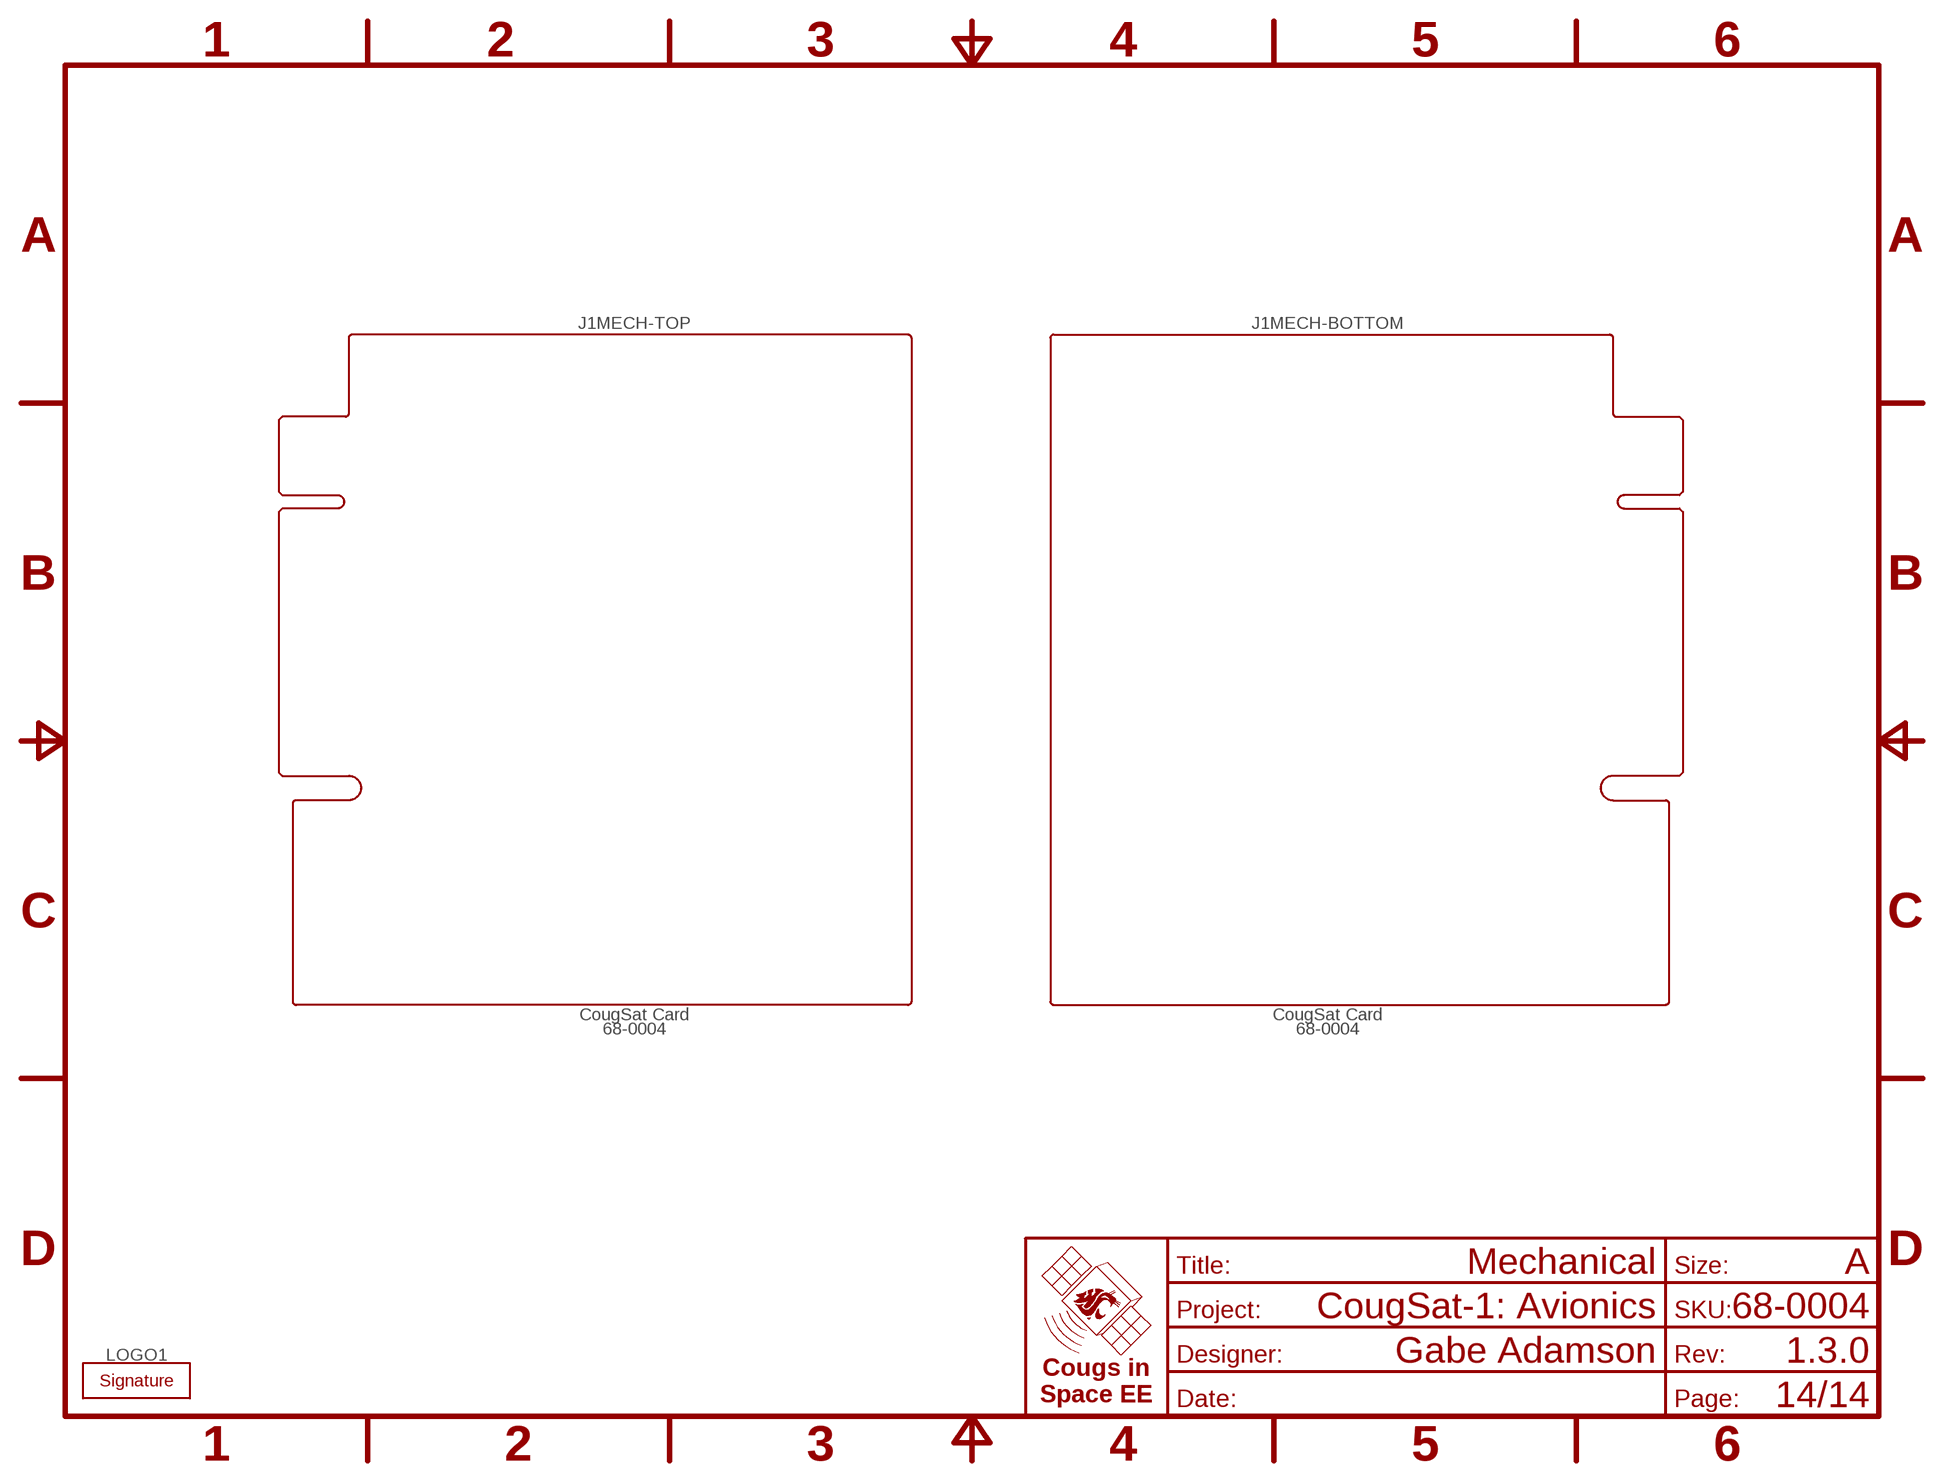
[diagram p13: schematic, sheet 14]
FRAME11 (FRAME-A): TITLE: Mechanical

### Parts
LOGO1  SIGNATUREGABE  [SIGN-GABE]

## Power pins joined to a net without a drawn wire
PR_3.3V-1: J1.A2(POWER:PR_3.3V-1) J1.B2(POWER:PR_3.3V-1)
PR_3.3V-3: J1.A4(POWER:PR_3.3V-3) J1.B4(POWER:PR_3.3V-3)
PR_3.3V-4: J1.A5(POWER:PR_3.3V-4) J1.B5(POWER:PR_3.3V-4)
PR_3.3V-6: J1.A7(POWER:PR_3.3V-6) J1.B7(POWER:PR_3.3V-6)
PR_3.3V-7: J1.A8(POWER:PR_3.3V-7) J1.B8(POWER:PR_3.3V-7)
PR_3.3V-8: J1.A9(POWER:PR_3.3V-8) J1.B9(POWER:PR_3.3V-8)
PR_3.3V-9: J1.A10(POWER:PR_3.3V-9) J1.B10(POWER:PR_3.3V-9)
PR_3.3V-10: J1.A11(POWER:PR_3.3V-10) J1.B11(POWER:PR_3.3V-10)
PR_3.3V-11: J1.A12(POWER:PR_3.3V-11) J1.B12(POWER:PR_3.3V-11)
PR_3.3V-12: J1.A13(POWER:PR_3.3V-12) J1.B13(POWER:PR_3.3V-12)
PR_BATT-0: J1.A14(POWER:PR_BATT-0) J1.B14(POWER:PR_BATT-0)
PR_BATT-1: J1.A15(POWER:PR_BATT-1) J1.B15(POWER:PR_BATT-1)
PR_BATT-2: J1.A16(POWER:PR_BATT-2) J1.B16(POWER:PR_BATT-2)
PR_BATT-3: J1.A17(POWER:PR_BATT-3) J1.B17(POWER:PR_BATT-3)
PR_BATT-4: J1.A18(POWER:PR_BATT-4) J1.B18(POWER:PR_BATT-4)
PR_BATT-6: J1.A20(POWER:PR_BATT-6) J1.B20(POWER:PR_BATT-6)

## Library data of the parts
C1 C5-C8 C10 C11 C13 C14 C19 C20 C22 C23 C26 C27 C33-C37 C39 C44-C58 C61-C64 C67 C74 C78 C82-C94 = CougsInSpace-Capacitors:CAP-V: Capacitor - Vertical Orientation; PACKAGE: 1608; SKU: 11-104A; TEMP: X7R; VOLTAGE: 50V
C2 C4 C59 C79 C80 = CougsInSpace-Capacitors:CAP-V: Capacitor - Vertical Orientation; PACKAGE: 1608; SKU: 11-105A; TEMP: X5R; VOLTAGE: 6.3V
C3 C60 C81 = CougsInSpace-Capacitors:CAP-V: Capacitor - Vertical Orientation; PACKAGE: 1608; SKU: 11-106A; TEMP: X5R; VOLTAGE: 6.3V
C9 C40 = CougsInSpace-Capacitors:CAP-POL-V: Capacitor Polarized - Vertical Orientation; ESR: Max 900mΩ; PACKAGE: Tant-B; SKU: 16-475A; VOLTAGE: 20V
C12 C24 C38 = CougsInSpace-Capacitors:CAP-V: Capacitor - Vertical Orientation; PACKAGE: 1608; SKU: 11-682A; TEMP: C0G; VOLTAGE: 50V
C15 C18 C28 C30-C32 C41 C43 C72 C73 C75 C76 = CougsInSpace-Capacitors:CAP-V: Capacitor - Vertical Orientation; PACKAGE: 1608; SKU: 11-150A; TEMP: C0G; VOLTAGE: 100V
C16 C29 C42 = CougsInSpace-Capacitors:CAP-H: Capacitor - Horizontal Orientation; PACKAGE: 1608; SKU: 11-104A; TEMP: X7R; VOLTAGE: 50V
C17 C65 C66 = CougsInSpace-Capacitors:CAP-V: Capacitor - Vertical Orientation; PACKAGE: 1608; SKU: 11-103A; TEMP: X7R; VOLTAGE: 50V
C21 C25 C68-C71 = CougsInSpace-Capacitors:CAP-V: Capacitor - Vertical Orientation; PACKAGE: 1608; SKU: 11-100A; TEMP: C0G; VOLTAGE: 100V
C77 = CougsInSpace-Capacitors:CAP-POL-V: Capacitor Polarized - Vertical Orientation; ESR: Max 400mΩ; PACKAGE: Tant-B; SKU: 16-476A; VOLTAGE: 10V
DS1-DS3 = CougsInSpace-LEDs:LED-H: LED Horizontal; CURRENT: 20mA; PACKAGE: 1608; SKU: 63-0001; VF: 2.2V
DS4 = CougsInSpace-LEDs:LED-V: LED Vertical; CURRENT: 20mA; PACKAGE: 1608; SKU: 63-0004; VF: 3.3V
FB1 FB2 = CougsInSpace-Coils:CHOKE-H: Choke (Ferrite Bead) Horizontal; CURRENT: 500mA; DCR: 500mΩ; PACKAGE: 1608; SKU: 36-152A
J1 = CougsInSpace-Boards:CIS_CARD: CougSat Card; SKU: 68-0004
J2 J3 J5 J6 J9 J15 = CougsInSpace-Connectors:1X04: Generic Connector - 4 Conductor; PACKAGE: PicoLock; SKU: 04-0001
J4 J7 J8 = CougsInSpace-Connectors:SWD: Serial Wire Debug; PACKAGE: SMD-6-R; SKU: 04-0004
J10-J13 = CougsInSpace-Connectors:µSD-SW: µSD with Detection Switch; SKU: 04-0005
J14 = CougsInSpace-Connectors:COAX: Coax Connector; PACKAGE: U.FL; SKU: 04-0008
L1 = CougsInSpace-Coils:INDUCTOR-V: Inductor Vertical; CURRENT: 600mA; DCR: 220mΩ; PACKAGE: 1608; SKU: 31-330A
LOGO1 = CougsInSpace-Aesthetics:SIGNATURE: Designer's (Artist's) Signature
R1 R3 R5-R7 R9 R10 R13 R14 R18 R25 R28 = CougsInSpace-Resistors:RES-V: Resistor Vertical; PACKAGE: 1608; POWER: 1/8W; SKU: 21-1002; TEMP: 25ppm/°C
R2 R8 R15 R33 = CougsInSpace-Resistors:RES-V: Resistor Vertical; PACKAGE: 1608; POWER: 1/10W; SKU: 21-0000; TEMP: 70°C Max 2A
R4 R23 R24 R30 = CougsInSpace-Resistors:RES-H: Resistor Horizontal; PACKAGE: 1608; POWER: 1/8W; SKU: 21-1001; TEMP: 25ppm/°C
R11 R19 R20 = CougsInSpace-Resistors:RES-H: Resistor Horizontal; PACKAGE: 1608; POWER: 1/10W; SKU: 21-0000; TEMP: 70°C Max 2A
R12 R16 R17 R21 R22 R26 R27 = CougsInSpace-Resistors:RES-V: Resistor Vertical; PACKAGE: 1608; POWER: 1/8W; SKU: 21-1001; TEMP: 25ppm/°C
R29 R31 R32 = CougsInSpace-Resistors:RES-H: Resistor Horizontal; PACKAGE: 1608; POWER: 1/5W; SKU: 21-0.05; TEMP: 75ppm/°C
RN1 RN2 RN4 = CougsInSpace-Resistors:RES_BUS-10: Resistor Bussed Array All resistors share a common terminal; PACKAGE: 3264; POWER: 1/16W; SKU: 26-0001; TEMP: 200ppm/°C
RN3 = CougsInSpace-Resistors:RES-H-PAIRED: Resistor Horizontal - Two Paired Elements; PACKAGE: 1616; POWER: 1/8W; SKU: 26-0006; TEMP: ±10ppm/°C
RT1-RT19 = CougsInSpace-Resistors:THERMISTOR-V: Thermistor Vertical; B2585: 3960K 1%; PACKAGE: 1608; SKU: 26-0008
TP1 TP2 = CougsInSpace-Connectors:TEST_POINT: Test Point Used to probe points in a circuit for debugging or general measurement
U1 U15 U22 = CougsInSpace-IC-Conversion:AD7291: AD7291 12b ADC with 8-single ended channels. I²C interface; SKU: 27-0003
U2 U20 U21 U24 = CougsInSpace-IC-Amplifiers:OPAMP-1: Operational Amplifier - Single; SKU: 08-0002
U3 U4 = CougsInSpace-IC-Memory:EEPROM-I2C-4: EEPROM I²C - 4 Addresses M24M01 <https://github.com/CougsInSpace/Resources/blob/master/SupplierDocuments/ST/M24M01_EEPROM-I2C.pdf>; SKU: 29-0001
U5 U7 U10 = CougsInSpace-Sensors:BNO055: 9-DOF IMU BMO055 <https://github.com/CougsInSpace/Resources/blob/master/SupplierDocuments/Bosch/BMO055.pdf>; SKU: 66-0002
U6 U17 U18 = CougsInSpace-IC-µController:STM32-64P-?*: STM 32b µController - 64 Pin STM32L476Rx <https://github.com/CougsInSpace/Resources/blob/master/SupplierDocuments/ST/STM32L476.pdf> STM32L496Rx <https://github.com/CougsInSpace/Resources/blob/master/SupplierDocuments/ST/STM32L496.pdf>; EXTRAPIN: PD2; FLASH: 1MB; SKU: 61-0002
U8 U9 U11-U14 U16 U19 = CougsInSpace-IC-Comms:LEVEL_SHIFTER-2BIT: Logic Level Shifter Bidirectional - 2b; SKU: 09-0001
U23 U26 U29 = CougsInSpace-IC-Amplifiers:INA199: INA199 Current-sense amplifier; GAIN: 100 V/V; SKU: 08-0004
U25 U28 U30 = CougsInSpace-IC-Other:DRV883*: H-Bridge Driver DRV883x <https://github.com/CougsInSpace/Resources/blob/master/SupplierDocuments/Ti/DRV8837_HBridge.pdf>; CONTROL: PWM; SKU: 62-0003
U27 = CougsInSpace-RF:VENUS838FLPX: GPS Reciever - GPIO Venus838FLPx <https://github.com/CougsInSpace/Resources/blob/master/SupplierDocuments/SkyTraq/Venus838FLPx-SPC_CubeSatGPS.pdf>; SKU: 65-0001
Y1 Y3-Y5 Y8 Y9 = CougsInSpace-Clocks:CRYSTAL: Crystal; LOADCAP: 12.5pF; SKU: 40-323A
Y2 Y6 Y7 = CougsInSpace-Clocks:CRYSTAL-GROUNDED: Crystal Grounded; LOADCAP: 10pF; SKU: 40-805A

## Net classes
1 Power: width 0.2 mm